# Altium project ProbeAmp.PrjPcb
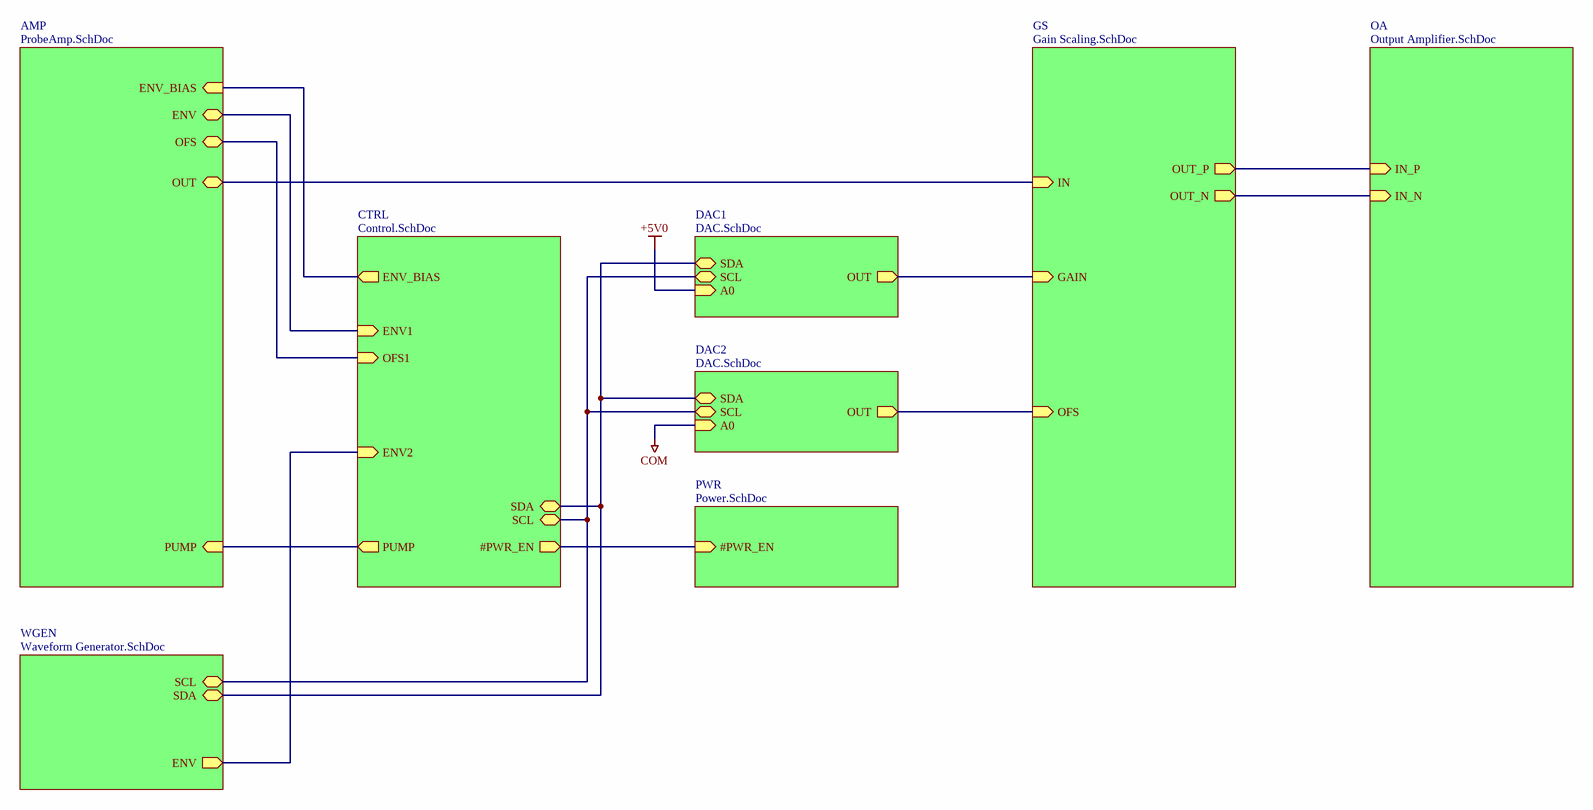
[diagram p0: Top.SchDoc]
8 sheets, 153 parts. Net scope: hierarchical (ports join the sheet entries above them; power ports are global).
Sheets:
  Top.SchDoc
    PWR = Power.SchDoc
    AMP = ProbeAmp.SchDoc
    DAC1 = DAC.SchDoc
    DAC2 = DAC.SchDoc
    CTRL = Control.SchDoc
    WGEN = Waveform Generator.SchDoc
    GS = Gain Scaling.SchDoc
    OA = Output Amplifier.SchDoc

## Sheet Top.SchDoc
size 406 x 304 mm; SheetNumber: 1; SheetTotal: 8

### Sub-sheets
AMP = ProbeAmp.SchDoc: OUT (bidir), OFS (bidir), ENV (bidir), ENV_BIAS (in), PUMP (in)
CTRL = Control.SchDoc: OFS1 (in), ENV1 (in), ENV2 (in), SCL (bidir), SDA (bidir), #PWR_EN (out), PUMP (out), ENV_BIAS (out)
DAC1 = DAC.SchDoc: OUT (out), SCL (bidir), SDA (bidir), A0 (in)
DAC2 = DAC.SchDoc: OUT (out), SCL (bidir), SDA (bidir), A0 (in)
GS = Gain Scaling.SchDoc: IN (in), OUT_P (out), OUT_N (out), GAIN (in), OFS (in)
OA = Output Amplifier.SchDoc: IN_P (in), IN_N (in)
PWR = Power.SchDoc: #PWR_EN (in)
WGEN = Waveform Generator.SchDoc: SCL (bidir), SDA (bidir), ENV (out)

### Nets
#PWR_EN: sheet PWR/#PWR_EN, sheet CTRL/#PWR_EN
SCL: sheet DAC1/SCL, sheet DAC2/SCL, sheet CTRL/SCL, sheet WGEN/SCL
SDA: sheet DAC1/SDA, sheet DAC2/SDA, sheet CTRL/SDA, sheet WGEN/SDA
NetC?#28_1: sheet AMP/PUMP, sheet CTRL/PUMP
NetC?#43_2: sheet CTRL/ENV2, sheet WGEN/ENV
NetC?#48_2: sheet GS/OUT_P, sheet OA/IN_P
NetC?#50_2: sheet GS/OUT_N, sheet OA/IN_N
NetC?_DAC1#2_2: sheet DAC1/OUT, sheet GS/GAIN
NetC?_DAC2#2_2: sheet DAC2/OUT, sheet GS/OFS
NetD2_1: sheet AMP/OUT, sheet GS/IN
NetD?#1_1: sheet AMP/ENV_BIAS, sheet CTRL/ENV_BIAS
NetU?#9_1: sheet AMP/ENV, sheet CTRL/ENV1
NetU?#10_6: sheet AMP/OFS, sheet CTRL/OFS1

### Notes on the sheet
- Sheet Name:
- Date:
- Sheet
- Designer:
- of

## Sheet Power.SchDoc
size 406 x 304 mm; SheetNumber: 2; SheetTotal: 8
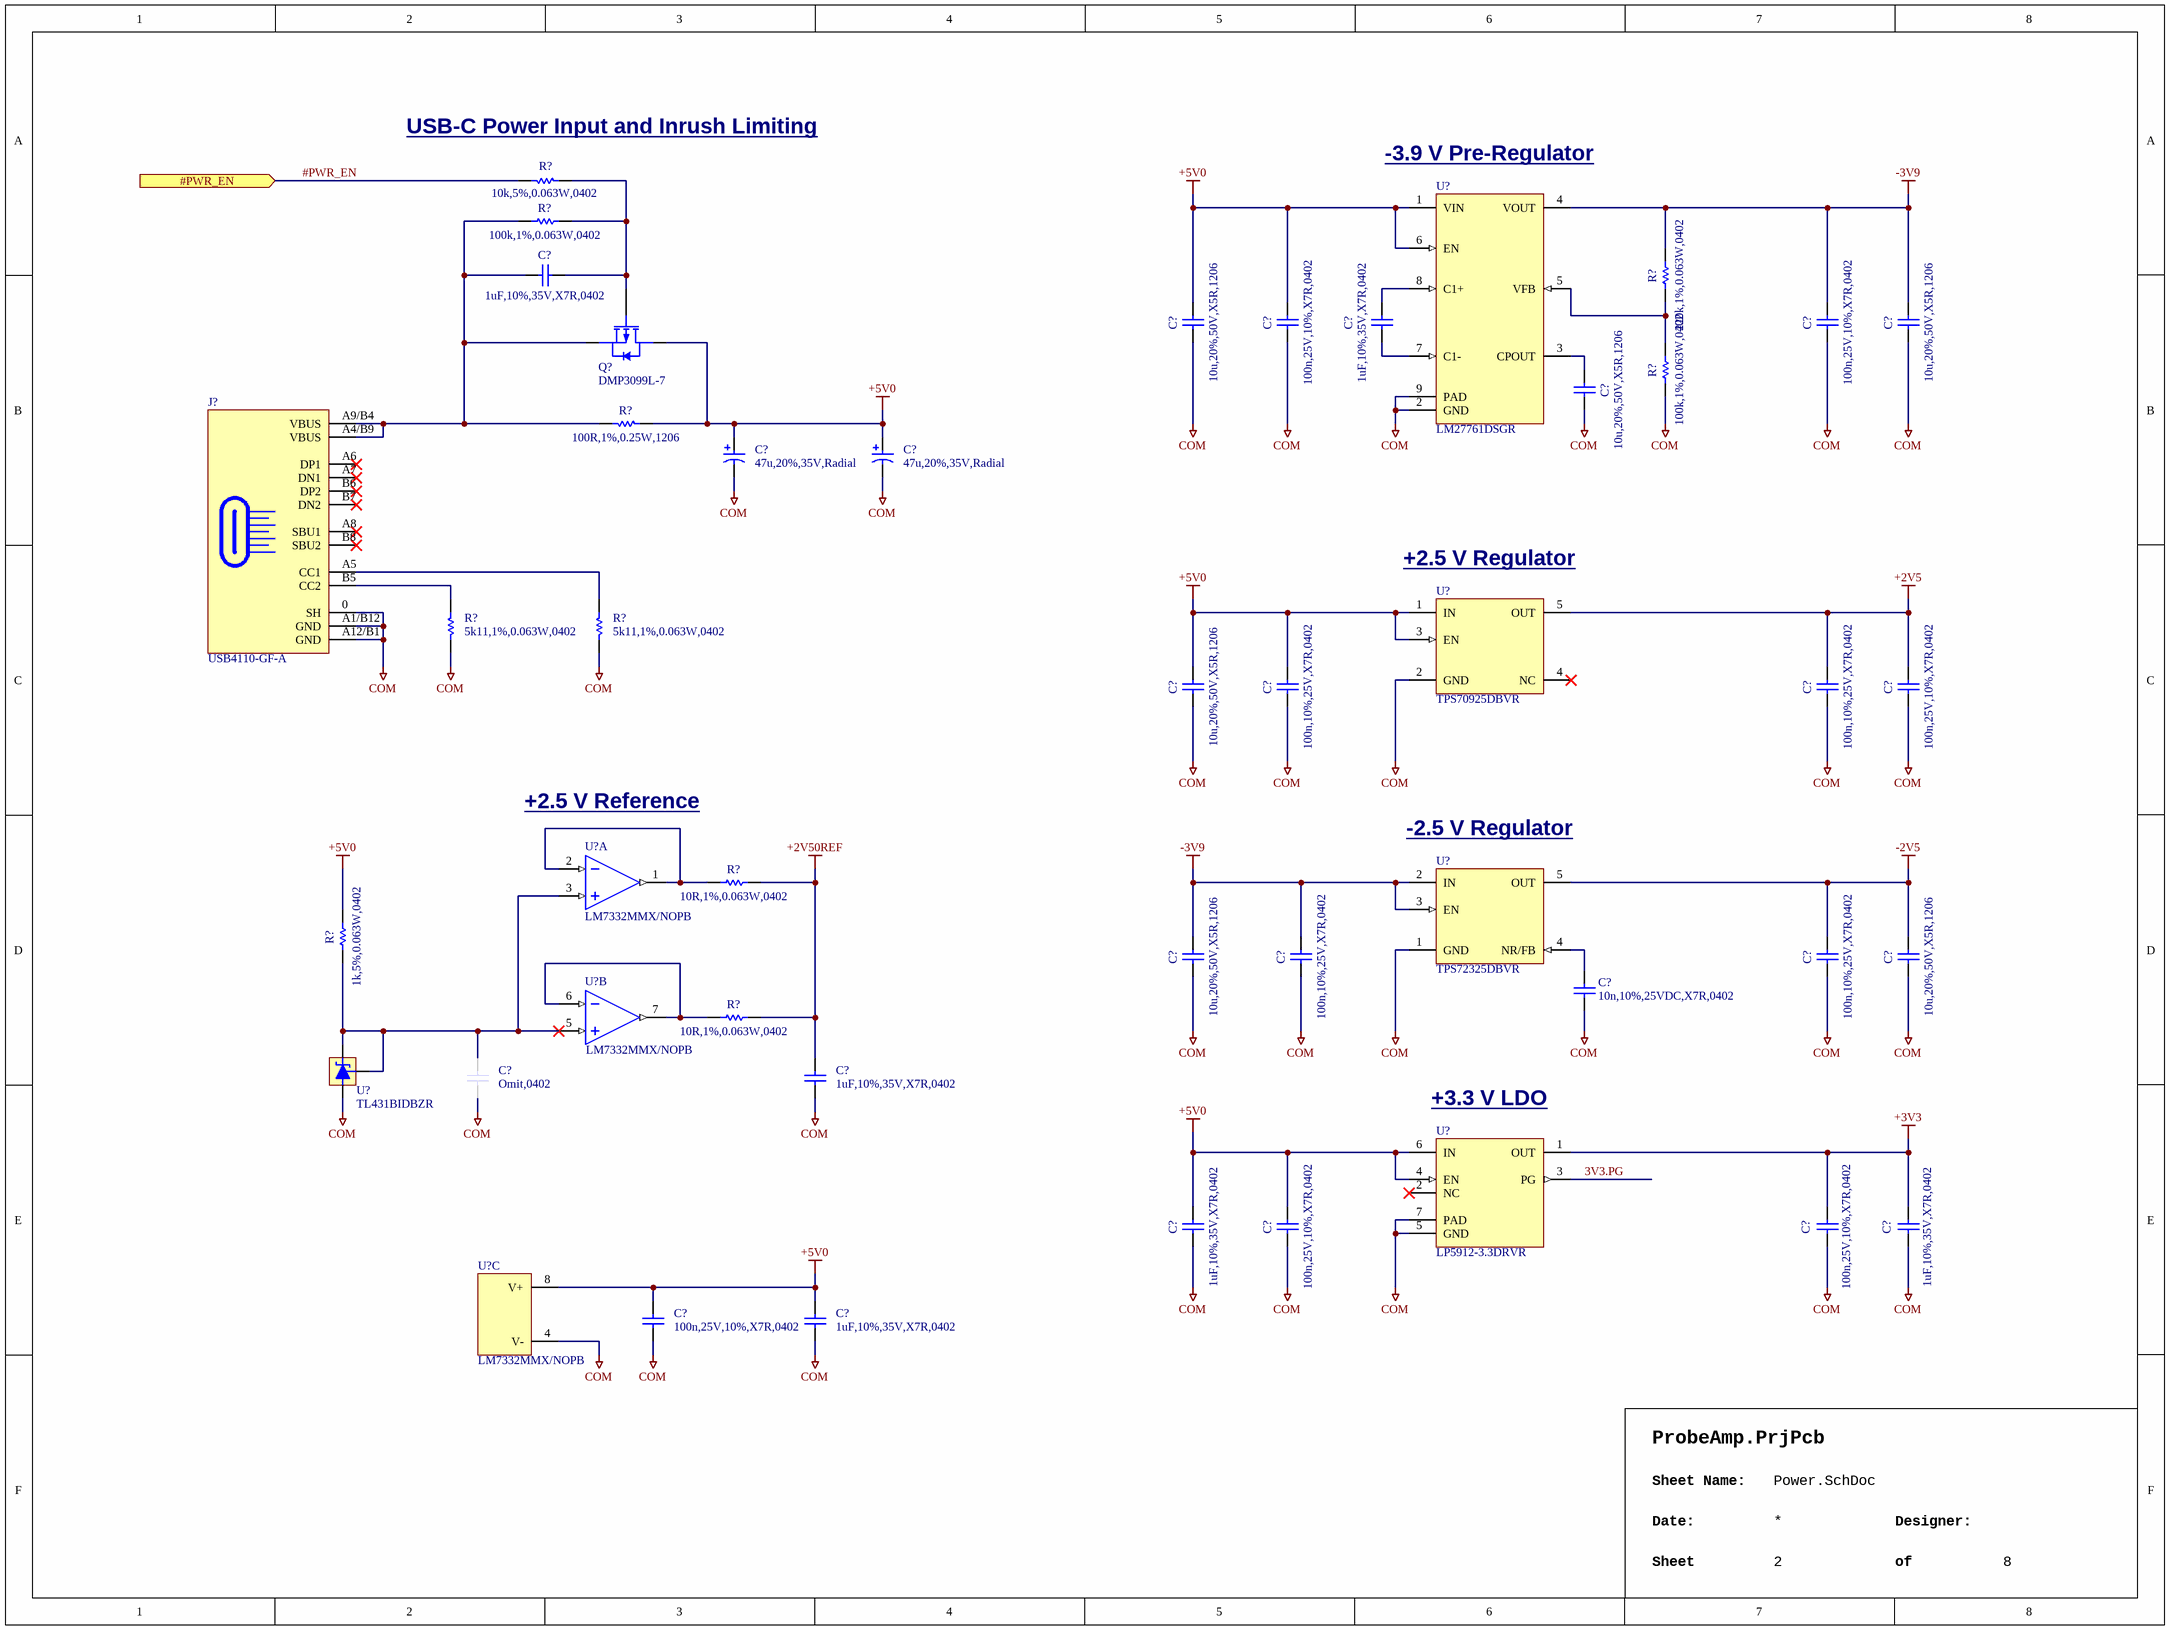
[diagram p1: Power.SchDoc]

### Parts
(Parts that share a designator on the sheet are numbered #1, #2 ... from top to bottom, then left to right.)
C?#1  1uF,10%,35V,X7R,0402  [CAPC1005X06N]
C?#2  10u,20%,50V,X5R,1206  [CAPC3216X16N]
C?#3  100n,25V,10%,X7R,0402  [CAPC1005X06N]
C?#4  1uF,10%,35V,X7R,0402  [CAPC1005X06N]
C?#5  100n,25V,10%,X7R,0402  [CAPC1005X06N]
C?#6  10u,20%,50V,X5R,1206  [CAPC3216X16N]
C?#7  10u,20%,50V,X5R,1206  [CAPC3216X16N]
C?#8  47u,20%,35V,Radial  [KEMET_ESKXXXXXXXXC3XX]
C?#9  47u,20%,35V,Radial  [KEMET_ESKXXXXXXXXC3XX]
C?#10  10u,20%,50V,X5R,1206  [CAPC3216X16N]
C?#11  100n,10%,25V,X7R,0402  [CAPC1005X06N]
C?#12  100n,10%,25V,X7R,0402  [CAPC1005X06N]
C?#13  100n,25V,10%,X7R,0402  [CAPC1005X06N]
C?#14  10u,20%,50V,X5R,1206  [CAPC3216X16N]
C?#15  100n,10%,25V,X7R,0402  [CAPC1005X06N]
C?#16  100n,10%,25V,X7R,0402  [CAPC1005X06N]
C?#17  10u,20%,50V,X5R,1206  [CAPC3216X16N]
C?#18  10n,10%,25VDC,X7R,0402  [CAPC1005X06N]
C?#19  Omit,0402  [CAPC1005X06N]  (no BOM)
C?#20  1uF,10%,35V,X7R,0402  [CAPC1005X06N]
C?#21  1uF,10%,35V,X7R,0402  [CAPC1005X06N]
C?#22  100n,25V,10%,X7R,0402  [CAPC1005X06N]
C?#23  100n,25V,10%,X7R,0402  [CAPC1005X06N]
C?#24  1uF,10%,35V,X7R,0402  [CAPC1005X06N]
C?#25  100n,25V,10%,X7R,0402  [CAPC1005X06N]
C?#26  1uF,10%,35V,X7R,0402  [CAPC1005X06N]
J?#1  USB4110-GF-A  [GCT_USB4110-GF-A]
Q?  DMP3099L-7  [DIODES_SOT23]
R?#1  10k,5%,0.063W,0402  [RESC1005X04N]
R?#2  100k,1%,0.063W,0402  [RESC1005X04N]
R?#3  220k,1%,0.063W,0402  [RESC1005X04N]
R?#4  100k,1%,0.063W,0402  [RESC1005X04N]
R?#5  100R,1%,0.25W,1206  [SEI_PKG_RMCF1206]
R?#6  5k11,1%,0.063W,0402  [RESC1005X04N]
R?#7  5k11,1%,0.063W,0402  [RESC1005X04N]
R?#8  10R,1%,0.063W,0402  [RESC1005X04N]
R?#9  1k,5%,0.063W,0402  [RESC1005X04N]
R?#10  10R,1%,0.063W,0402  [RESC1005X04N]
U?#1  LM27761DSGR  [TEXASINSTRUMENTS_PKG_DSG0008A]
U?#2  TPS70925DBVR  [TEXASINSTRUMENTS_PKG_DBV0005A]
U?#3  LM7332MMX/NOPB  [TEXASINSTRUMENTS_PKG_DGK0008A]  (part A of 3)
U?#4  TPS72325DBVR  [TEXASINSTRUMENTS_PKG_DBV0005A]
U?#5  LM7332MMX/NOPB  [TEXASINSTRUMENTS_PKG_DGK0008A]  (part B of 3)
U?#6  TL431BIDBZR  [SOT95P240X120-3N]
U?#7  LP5912-3.3DRVR  [SON65P200X80-6N]
U?#8  LM7332MMX/NOPB  [TEXASINSTRUMENTS_PKG_DGK0008A]  (part C of 3)

### Ports
#PWR_EN (in)

### Nets
+2V5: C?#12.2 C?#13.2 U?#2.5(OUT)
+2V50REF: C?#20.2 R?#8.2 R?#10.2
+3V3: C?#23.2 C?#24.2 U?#7.1(OUT)
+5V0: C?#2.2 C?#3.2 C?#8.1 C?#9.1 C?#10.2 C?#11.2 C?#21.2 C?#22.2 C?#25.2 C?#26.2 Q?.3(D) R?#5.1 R?#9.2 U?#1.1(VIN) U?#1.6(EN) U?#2.1(IN) U?#2.3(EN) U?#7.4(EN) U?#7.6(IN) U?#8.8(V+)  [project net A0]
-2V5: C?#16.2 C?#17.2 U?#4.5(OUT)
-3V9: C?#5.2 C?#6.2 C?#14.2 C?#15.2 R?#3.1 U?#1.4(VOUT) U?#4.2(IN) U?#4.3(EN)
COM: C?#2.1 C?#3.1 C?#5.1 C?#6.1 C?#7.1 C?#8.2 C?#9.2 C?#10.1 C?#11.1 C?#12.1 C?#13.1 C?#14.1 C?#15.1 C?#16.1 C?#17.1 C?#18.1 C?#19.1 C?#20.1 C?#21.1 C?#22.1 C?#23.1 C?#24.1 C?#25.1 C?#26.1 J?#1.0(SH) J?#1.A1/B12(GND) J?#1.A12/B1(GND) R?#4.2 R?#6.2 R?#7.2 U?#1.2(GND) U?#1.9(PAD) U?#2.2(GND) U?#4.1(GND) U?#6.3 U?#7.5(GND) U?#7.7(PAD) U?#8.4(V-)  [project net A0]
3V3.PG: U?#7.3(PG)
#PWR_EN: R?#1.1 ; port #PWR_EN
NetC?#1_1: C?#1.1 Q?.1(G) R?#1.2 R?#2.2
NetC?#1_2: C?#1.2 J?#1.A4/B9(VBUS) J?#1.A9/B4(VBUS) Q?.2(S) R?#2.1 R?#5.2
NetC?#4_1: C?#4.1 U?#1.7(C1-)
NetC?#4_2: C?#4.2 U?#1.8(C1+)
NetC?#7_2: C?#7.2 U?#1.3(CPOUT)
NetC?#18_2: C?#18.2 U?#4.4(NR/FB)
NetC?#19_2: C?#19.2 R?#9.1 U?#3.3(INA+) U?#5.5(INB+) U?#6.1 U?#6.2
NetJ?#1_A5: J?#1.A5(CC1) R?#7.1
NetJ?#1_B5: J?#1.B5(CC2) R?#6.1
NetR?#3_2: R?#3.2 R?#4.1 U?#1.5(VFB)
NetR?#8_1: R?#8.1 U?#3.1(OUTA) U?#3.2(INA-)
NetR?#10_1: R?#10.1 U?#5.6(INB-) U?#5.7(OUTB)

Not connected (* = marked no-connect by the designer): J?#1 A6(DP1)* A7(DN1)* A8(SBU1)* B6(DP2)* B7(DN2)* B8(SBU2)*; U?#2 4(NC)*; U?#7 2(NC)*

### Notes on the sheet
- (near R?#1) USB-C Power Input and Inrush Limiting
- (near U?#1) -3.9 V Pre-Regulator
- (near U?#2) +2.5 V Regulator
- +2.5 V Reference
- (near U?#4) -2.5 V Regulator
- (near U?#7) +3.3 V LDO
- Sheet Name:
- Date:
- Sheet
- Designer:
- of

### Library data of the parts
C?#1 C?#4 C?#20 C?#21 C?#24 C?#26 = CAP,Cer,1uF,35VDC,X5R,0402: 1 ï¿½F ï¿½10% 35V Ceramic Capacitor X5R 0402 (1005 Metric); Manufacturer 1: TDK Corporation; Manufacturer 1 Part Number: C1005X5R1V105K050BC; Vendor 1 Part Number: 445-9073-1-ND; Vendor 1: Digikey; Value: 1u; Part Name: CAP,Cer,1uF,35VDC,X5R,0402; CreatedBy: Judd Foster; HelpURL: https://product.tdk.com/info/en/catalog/datasheets/mlcc_commercial_general_en.pdf?ref_disty=digikey
C?#2 C?#6 C?#7 C?#10 C?#14 C?#17 = CAP,Cer,10uF,50VDC,X5R,1206: 10ï¿½F ï¿½20% 50V Ceramic Capacitor X5R 1206 (3216 Metric); Manufacturer 1: Samsung Electro-Mechanics; Manufacturer 1 Part Number: CL31A106MBHNNNE; Vendor 1 Part Number: 1276-6736-1-ND; Vendor 1: Digikey; Part Name: CAP,Cer,10uF,50VDC,X5R,1206; CreatedBy: Judd Foster; HelpURL: https://www.samsungsem.com/resources/file/global/support/product_catalog/MLCC.pdf; Value: 10u
C?#3 C?#5 C?#13 C?#22 C?#23 C?#25 = CAP,Cer,100nF,10%,25VDC,X7R,0402: 0.1ï¿½F ï¿½10% 25V Ceramic Capacitor X7R 0402 (1005 Metric); Manufacturer 1: Murata Electronics; Manufacturer 1 Part Number: GRM155R71E104KE14J; Vendor 1 Part Number: 490-14603-1-ND; Vendor 1: DigiKey; Value: 100nF; Part Name: CAP,Cer,100nF,10%,25VDC,X7R,0402; CreatedBy: Judd Foster; HelpURL: https://search.murata.co.jp/Ceramy/image/img/A01X/G101/ENG/GRM155R71E104KE14-01.pdf
C?#8 C?#9 = CAP,Alum,47uF,20%,35V,Radial: 47 ÂµF 35 V Aluminum Electrolytic Capacitors Radial, Can 2000 Hrs @ 85Â°C; Manufacturer 1: KEMET; Manufacturer 1 Part Number: ESK476M035AC3EA; Vendor 1 Part Number: 399-18276-1-ND; Vendor 1: Digikey; Part Name: CAP,Alum,47uF,20%,35V,Radial; CreatedBy: Judd Foster; HelpURL: https://connect.kemet.com:7667/gateway/IntelliData-ComponentDocumentation/1.0/download/datasheet/ESK476M035AC3EA; Value: 47u
C?#11 C?#12 C?#15 C?#16 = CAP,Cer,100nF,10%,25V,X7R,0402: 0.1ï¿½F ï¿½10% 25V Ceramic Capacitor X7R 0402 (1005 Metric); Manufacturer 1: Murata Electronics; Manufacturer 1 Part Number: GRM155R71E104KE14J; Vendor 1 Part Number: 490-14603-1-ND; Vendor 1: DigiKey; Value: 100nF; Part Name: CAP,Cer,100nF,10%,25V,X7R,0402; CreatedBy: Judd Foster; HelpURL: https://search.murata.co.jp/Ceramy/image/img/A01X/G101/ENG/GRM155R71E104KE14-01.pdf
C?#18 = CAP,Cer,10nF,10%,25VDC,X7R,0402: 10000pF ï¿½10% 25V Ceramic Capacitor X7R 0402 (1005 Metric); Manufacturer 1: Murata Electronics; Manufacturer 1 Part Number: GCM155R71E103KA37D; Vendor 1 Part Number: 490-6043-1-ND; Vendor 1: Digikey; Part Name: CAP,Cer,10nF,10%,25VDC,X7R,0402; CreatedBy: Judd Foster; HelpURL: https://psearch.en.murata.com/capacitor/product/GCM155R71E103KA37%23.pdf; Value: 10n,10%,25VDC,X7R,0402
C?#19 = CAP,Omit,0402: Omit; Part Name: CAP,Omit,0402; CreatedBy: Judd Foster; HelpURL: N/A; Manufacturer 1: N/A; Manufacturer 1 Part Number: N/A; Vendor 1: N/A; Vendor 1 Part Number: N/A; Value: Omit
J?#1 = Conn,USB_C,SMD: USB-C (USB TYPE-C) USB 2.0 Receptacle Connector 24 (16+8 Dummy) Position Surface Mount, Right Angle; Manufacturer 1: GCT; Vendor 1 Part Number: 2073-USB4110-GF-A-1-ND; Vendor 1: Digikey; Part Name: Conn,USB_C,SMD; CreatedBy: Judd Foster; HelpURL: https://gct.co/files/drawings/usb4110.pdf; Manufacturer 1 Part Number: USB4110-GF-A
Q? = MOSFET,P Ch,30V,3.8A: P-Channel 30 V 3.8A (Ta) 1.08W (Ta) Surface Mount SOT-23-3; Manufacturer 1: Diodes Incorporated; Vendor 1 Part Number: DMP3099L-7DICT-ND; Vendor 1: Digikey; Part Name: MOSFET,P Ch,30V,3.8A; CreatedBy: Judd Foster; HelpURL: https://www.diodes.com/assets/Datasheets/DMP3099L.pdf; Manufacturer 1 Part Number: DMP3099L-7
R?#1 = RES,10k,5%,0.063W,0402: 10 kOhms ï¿½5% 0.063W, 1/16W Chip Resistor 0402 (1005 Metric) Automotive AEC-Q200 Thick Film; Manufacturer 1: Stackpole Electronics Inc; Manufacturer 1 Part Number: RMCF0402JT10K0; Vendor 1 Part Number: RMCF0402JT10K0CT-ND; Vendor 1: DIgikey; Part Name: RES,10k,5%,0.063W,0402; CreatedBy: Judd Foster; HelpURL: https://www.seielect.com/catalog/sei-rmcf_rmcp.pdf; Value: 10k
R?#2 R?#4 = RES,100k,1%,0.063W,0402: 100 kOhms Â±1% 0.063W, 1/16W Chip Resistor 0402 (1005 Metric) Moisture Resistant Thick Film; Manufacturer 1: YAGEO; Manufacturer 1 Part Number: RC0402FR-07100KL; Vendor 1 Part Number: 311-100KLRCT-ND; Vendor 1: DigiKey; Part Name: RES,100k,1%,0.063W,0402; CreatedBy: Judd Foster; HelpURL: https://www.yageo.com/upload/media/product/products/datasheet/rchip/PYu-RC_Group_51_RoHS_L_12.pdf; Value: 100k
R?#3 = RES,220k,1%,0.063W,0402: 220 kOhms Â±1% 0.063W, 1/16W Chip Resistor 0402 (1005 Metric) Moisture Resistant Thick Film; Manufacturer 1: YAGEO; Manufacturer 1 Part Number: RC0402FR-07220KL; Vendor 1 Part Number: 311-220KLRCT-ND; Vendor 1: Digikey; Part Name: RES,220k,1%,0.063W,0402; CreatedBy: Judd Foster; HelpURL: https://www.yageo.com/upload/media/product/products/datasheet/rchip/PYu-RC_Group_51_RoHS_L_12.pdf; Value: 220k
R?#5 = RES,100R,1%,0.25W,1206: 100 Ohms Â±1% 0.25W, 1/4W Chip Resistor 1206 (3216 Metric) Automotive AEC-Q200 Thick Film; Manufacturer 1: Stackpole Electronics Inc; Manufacturer 1 Part Number: RMCF1206FT100R; Vendor 1 Part Number: RMCF1206FT100RCT-ND; Vendor 1: DigiKey; Part Name: RES,100R,1%,0.25W,1206; CreatedBy: Judd Foster; HelpURL: https://www.seielect.com/catalog/sei-rmcf_rmcp.pdf; Value: 100R
R?#6 R?#7 = RES,5k11,1%,0.063W,0402: 5.11 kOhms ï¿½1% 0.063W, 1/16W Chip Resistor 0402 (1005 Metric) Automotive AEC-Q200, Moisture Resistant Thick Film; Manufacturer 1: Yageo; Manufacturer 1 Part Number: AC0402FR-075K11L; Vendor 1 Part Number: 13-AC0402FR-075K11LCT-ND; Vendor 1: Digikey; Part Name: RES,5k11,1%,0.063W,0402; CreatedBy: Judd Foster; HelpURL: https://www.yageo.com/upload/media/product/productsearch/datasheet/rchip/PYu-AC_51_RoHS_L_7.pdf; Value: 5k11
R?#8 R?#10 = RES,10R,1%,0.063W,0402: 10 Ohms ï¿½1% 0.063W, 1/16W Chip Resistor 0402 (1005 Metric) Automotive AEC-Q200 Thick Film; Manufacturer 1: Panasonic Electronic Components; Manufacturer 1 Part Number: ERJ-2RKF10R0X; Vendor 1 Part Number: P10.0LCT-ND; Vendor 1: Digikey; Part Name: RES,10R,1%,0.063W,0402; CreatedBy: Judd Foster; HelpURL: https://industrial.panasonic.com/cdbs/www-data/pdf/RDA0000/AOA0000C304.pdf; Value: 10R
R?#9 = RES,1k,5%,0.063W,0402: 1 kOhms ï¿½5% 0.063W, 1/16W Chip Resistor 0402 (1005 Metric) Automotive AEC-Q200 Thick Film; Manufacturer 1: Stackpole Electronics Inc; Manufacturer 1 Part Number: RMCF0402JT1K00; Vendor 1 Part Number: RMCF0402JT1K00CT-ND; Vendor 1: DIgikey; Part Name: RES,1k,5%,0.063W,0402; CreatedBy: Judd Foster; HelpURL: https://www.seielect.com/catalog/sei-rmcf_rmcp.pdf; Value: 1k
U?#1 = LM27761DSGR: Charge Pump Switching Regulator IC Negative Adjustable -1.5V 1 Output 250mA 8-WFDFN Exposed Pad; Manufacturer 1: Texas Instruments; Vendor 1 Part Number: 296-44379-1-ND; Vendor 1: DigiKey; Part Name: LM27761DSGR; CreatedBy: Judd Foster; HelpURL: https://www.ti.com/lit/ds/symlink/lm27761.pdf?HQS=dis-dk-null-digikeymode-dsf-pf-null-wwe&ts=1736913234763&ref_url=https%253A%252F%252Fwww.ti.com%252Fgeneral%252Fdocs%252Fsuppproductinfo.tsp%253FdistId%253D10%2526gotoUrl%253Dhttps%253A%252F%252Fwww.ti.com; Manufacturer 1 Part Number: LM27761DSGR
U?#2 = TPS70925DBVR: Linear Voltage Regulator IC Positive Fixed 1 Output 150mA SOT-23-5; Manufacturer 1: Texas Instruments; Vendor 1 Part Number: 296-40923-1-ND; Vendor 1: DigiKey; Part Name: TPS70925DBVR; CreatedBy: Judd Foster; HelpURL: https://www.ti.com/lit/ds/symlink/tps709.pdf?HQS=dis-dk-null-digikeymode-dsf-pf-null-wwe&ts=1736883811582; Manufacturer 1 Part Number: TPS70925DBVR
U?#3 U?#5 U?#8 = LM7332MMX_NOPB: General Purpose Amplifier 2 Circuit Rail-to-Rail 8-VSSOP; Manufacturer 1: Texas Instruments; Vendor 1 Part Number: 296-LM7332MMX/NOPBCT-ND; Vendor 1: DigiKey; Part Name: LM7332MMX_NOPB; CreatedBy: Judd Foster; HelpURL: https://www.ti.com/lit/ds/symlink/lm7332.pdf?HQS=dis-dk-null-digikeymode-dsf-pf-null-wwe&ts=1730932081789&ref_url=https%253A%252F%252Fwww.ti.com%252Fgeneral%252Fdocs%252Fsuppproductinfo.tsp%253FdistId%253D10%2526gotoUrl%253Dhttps%253A%252F%252Fwww.ti.com%; Manufacturer 1 Part Number: LM7332MMX/NOPB
U?#4 = TPS72325DBVR: Linear Voltage Regulator IC Negative Fixed 1 Output 200mA SOT-23-5; Manufacturer 1: Texas Instruments; Vendor 1 Part Number: 296-39479-1-ND; Vendor 1: DigiKey; Part Name: TPS72325DBVR; CreatedBy: Judd Foster; HelpURL: https://www.ti.com/lit/ds/symlink/tps723.pdf?HQS=dis-dk-null-digikeymode-dsf-pf-null-wwe&ts=1736917966718&ref_url=https%253A%252F%252Fwww.ti.com%252Fgeneral%252Fdocs%252Fsuppproductinfo.tsp%253FdistId%253D10%2526gotoUrl%253Dhttps%253A%252F%252Fwww.ti.com%; Manufacturer 1 Part Number: TPS72325DBVR
U?#6 = TL431BIDBZR: IC VREF SHUNT 36V 0.5% SOT23-3; Manufacturer 1: Texas Instruments; Vendor 1 Part Number: 296-18872-1-ND; Vendor 1: Digikey; Part Name: TL431BIDBZR; CreatedBy: Judd Foster; HelpURL: http://www.ti.com/lit/ds/symlink/tl431.pdf; Manufacturer 1 Part Number: TL431BIDBZR
U?#7 = LP5912-3.3DRVR: Linear Voltage Regulator IC Positive Fixed 1 Output 500mA 6-WSON (2x2); Manufacturer 1: Texas Instruments; Vendor 1 Part Number: 296-47214-1-ND; Vendor 1: Digikey; Part Name: LP5912-3.3DRVR; CreatedBy: Judd Foster; HelpURL: http://www.ti.com/general/docs/suppproductinfo.tsp?distId=10&gotoUrl=http%3A%2F%2Fwww.ti.com%2Flit%2Fgpn%2Flp5912; Manufacturer 1 Part Number: LP5912-3.3DRVR

## Sheet ProbeAmp.SchDoc
size 406 x 304 mm; SheetNumber: 3; SheetTotal: 8
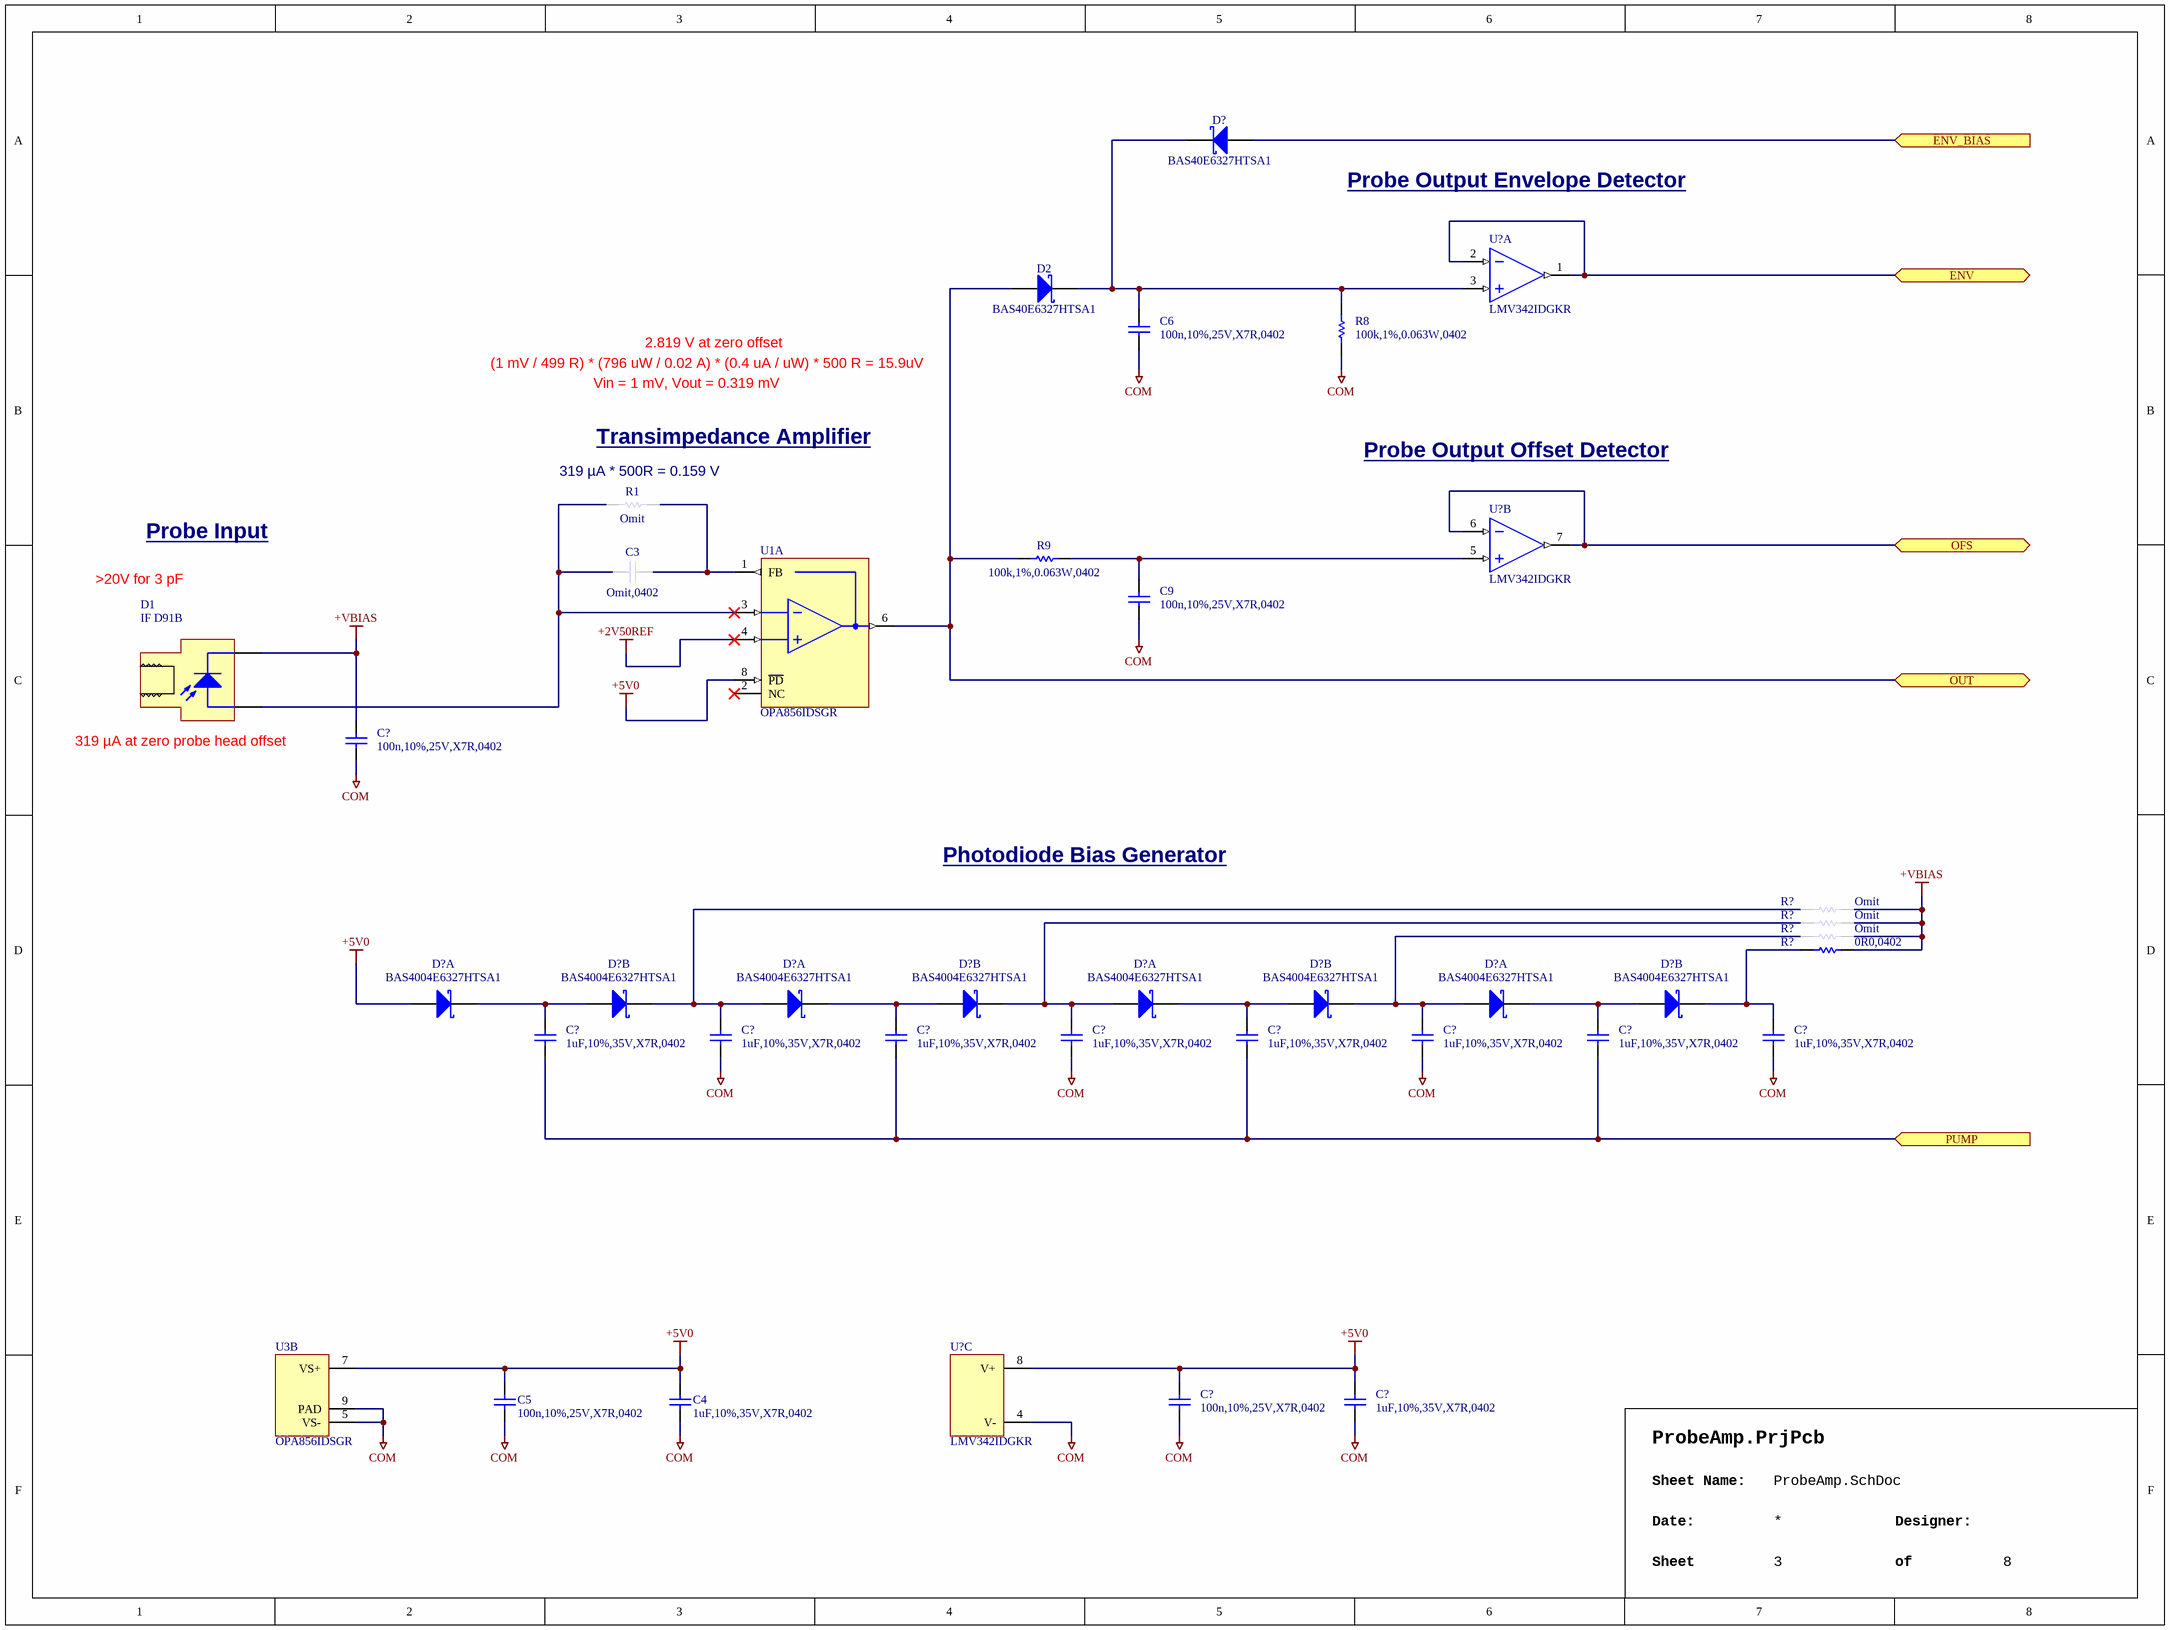
[diagram p2: ProbeAmp.SchDoc]

### Parts
(Parts that share a designator on the sheet are numbered #1, #2 ... from top to bottom, then left to right.)
C3  Omit,0402  [CAPC1005X06N]  (no BOM)
C4  1uF,10%,35V,X7R,0402  [CAPC1005X06N]
C5  100n,10%,25V,X7R,0402  [CAPC1005X06N]
C6  100n,10%,25V,X7R,0402  [CAPC1005X06N]
C9  100n,10%,25V,X7R,0402  [CAPC1005X06N]
C?#27  100n,10%,25V,X7R,0402  [CAPC1005X06N]
C?#28  1uF,10%,35V,X7R,0402  [CAPC1005X06N]
C?#29  1uF,10%,35V,X7R,0402  [CAPC1005X06N]
C?#30  1uF,10%,35V,X7R,0402  [CAPC1005X06N]
C?#31  1uF,10%,35V,X7R,0402  [CAPC1005X06N]
C?#32  1uF,10%,35V,X7R,0402  [CAPC1005X06N]
C?#33  1uF,10%,35V,X7R,0402  [CAPC1005X06N]
C?#34  1uF,10%,35V,X7R,0402  [CAPC1005X06N]
C?#35  1uF,10%,35V,X7R,0402  [CAPC1005X06N]
C?#36  100n,10%,25V,X7R,0402  [CAPC1005X06N]
C?#37  1uF,10%,35V,X7R,0402  [CAPC1005X06N]
D1  IF D91B  [INDUSTRIALFIBEROPTICS_IF-D91B]
D2  BAS40E6327HTSA1  [INFINEON_PKG_SOT23]
D?#1  BAS40E6327HTSA1  [INFINEON_PKG_SOT23]
D?#2  BAS4004E6327HTSA1  [INFINEON_PKG_SOT23]  (part A of 2)
D?#3  BAS4004E6327HTSA1  [INFINEON_PKG_SOT23]  (part B of 2)
D?#4  BAS4004E6327HTSA1  [INFINEON_PKG_SOT23]  (part A of 2)
D?#5  BAS4004E6327HTSA1  [INFINEON_PKG_SOT23]  (part B of 2)
D?#6  BAS4004E6327HTSA1  [INFINEON_PKG_SOT23]  (part A of 2)
D?#7  BAS4004E6327HTSA1  [INFINEON_PKG_SOT23]  (part B of 2)
D?#8  BAS4004E6327HTSA1  [INFINEON_PKG_SOT23]  (part A of 2)
D?#9  BAS4004E6327HTSA1  [INFINEON_PKG_SOT23]  (part B of 2)
R1  Omit  [RESC1005X04N]  (no BOM)
R8  100k,1%,0.063W,0402  [RESC1005X04N]
R9  100k,1%,0.063W,0402  [RESC1005X04N]
R?#11  Omit  [RESC1005X04N]  (no BOM)
R?#12  Omit  [RESC1005X04N]  (no BOM)
R?#13  Omit  [RESC1005X04N]  (no BOM)
R?#14  0R0,0402  [RESC1005X04N]
U1  OPA856IDSGR  [TEXASINSTRUMENTS_PKG_DSG0008A]  (part A of 2)
U3  OPA856IDSGR  [TEXASINSTRUMENTS_PKG_DSG0008A]  (part B of 2)
U?#9  LMV342IDGKR  [TEXASINSTRUMENTS_PKG_DGK0008A]  (part A of 3)
U?#10  LMV342IDGKR  [TEXASINSTRUMENTS_PKG_DGK0008A]  (part B of 3)
U?#11  LMV342IDGKR  [TEXASINSTRUMENTS_PKG_DGK0008A]  (part C of 3)

### Ports
ENV (bidir), ENV_BIAS (in), OFS (bidir), OUT (bidir), PUMP (in)

### Nets
+2V50REF: U1.4(IN+)
+5V0: C4.2 C5.2 C?#36.2 C?#37.2 D?#2.1(A) U1.8(~{PD}) U3.7(VS+) U?#11.8(V+)  [project net A0]
+VBIAS: C?#27.2 D1.2(K) R?#11.2 R?#12.2 R?#13.2 R?#14.1
COM: C4.1 C5.1 C6.1 C9.1 C?#27.1 C?#29.1 C?#31.1 C?#33.1 C?#35.1 C?#36.1 C?#37.1 R8.1 U3.5(VS-) U3.9(PAD) U?#11.4(V-)  [project net A0]
NetC3_1: C3.1 D1.1(A) R1.1 U1.3(IN-)
NetC3_2: C3.2 R1.2 U1.1(FB)
NetC6_2: C6.2 D2.3(K) D?#1.3(K) R8.2 U?#9.3(1IN+)
NetC9_2: C9.2 R9.1 U?#10.5(2IN-)
NetC?#28_1: C?#28.1 C?#30.1 C?#32.1 C?#34.1 ; port PUMP
NetC?#28_2: C?#28.2 D?#2.3(K) D?#3.1(A)
NetC?#29_2: C?#29.2 D?#3.3(K) D?#4.1(A) R?#11.1
NetC?#30_2: C?#30.2 D?#4.3(K) D?#5.1(A)
NetC?#31_2: C?#31.2 D?#5.3(K) D?#6.1(A) R?#12.1
NetC?#32_2: C?#32.2 D?#6.3(K) D?#7.1(A)
NetC?#33_2: C?#33.2 D?#7.3(K) D?#8.1(A) R?#13.1
NetC?#34_2: C?#34.2 D?#8.3(K) D?#9.1(A)
NetC?#35_2: C?#35.2 D?#9.3(K) R?#14.2
NetD2_1: D2.1(A) R9.2 U1.6(OUT) ; port OUT
NetD?#1_1: D?#1.1(A) ; port ENV_BIAS
NetU?#9_1: U?#9.1(1OUT) U?#9.2(1IN-) ; port ENV
NetU?#10_6: U?#10.6(2IN+) U?#10.7(2OUT) ; port OFS

Not connected (* = marked no-connect by the designer): U1 2(NC)*

### Notes on the sheet
- Probe Output Envelope Detector
- (1 mV / 499 R) * (796 uW / 0.02 A) * (0.4 uA / uW) * 500 R = 15.9uV
- 2.819 V at zero offset
- Vin = 1 mV, Vout = 0.319 mV
- (near R1) 319 µA * 500R = 0.159 V
- Transimpedance Amplifier
- Probe Output Offset Detector
- >20V for 3 pF
- Probe Input
- (near D1) 319 µA at zero probe head offset
- Photodiode Bias Generator
- Sheet Name:
- Date:
- Sheet
- Designer:
- of

### Library data of the parts
C3 = CAP,Omit,0402: Omit; Part Name: CAP,Omit,0402; CreatedBy: Judd Foster; HelpURL: N/A; Manufacturer 1: N/A; Manufacturer 1 Part Number: N/A; Vendor 1: N/A; Vendor 1 Part Number: N/A; Value: Omit
C4 C?#28-C?#35 C?#37 = CAP,Cer,1uF,35VDC,X5R,0402: as C?#1 on sheet Power; Part Name: CAP,Cer,1uF,35VDC,X5R,0402; CreatedBy: Judd Foster; HelpURL: https://product.tdk.com/info/en/catalog/datasheets/mlcc_commercial_general_en.pdf?ref_disty=digikey
C5 C6 C9 C?#27 C?#36 = CAP,Cer,100nF,10%,25V,X7R,0402: as C?#11 on sheet Power; Part Name: CAP,Cer,100nF,10%,25V,X7R,0402; CreatedBy: Judd Foster; HelpURL: https://search.murata.co.jp/Ceramy/image/img/A01X/G101/ENG/GRM155R71E104KE14-01.pdf
D1 = RECEIVER,FIBER OPTIC,450-1050NM,IF-D91B: Fiber Optic Receiver General Purpose 100Mbps; Manufacturer 1: Industrial Fiber Optics; Vendor 1 Part Number: FB200-ND; Vendor 1: DigiKey; Part Name: RECEIVER,FIBER OPTIC,450-1050NM,IF-D91B; CreatedBy: Judd Foster; HelpURL: https://i-fiberoptics.com/pdf/ifd91b-1809.pdf; Manufacturer 1 Part Number: IF D91B
D2 D?#1 = Diode,Schottky,40V,1A,SOT23: Diode 40 V 120mA Surface Mount PG-SOT23; Manufacturer 1: Infineon Technologies; Vendor 1 Part Number: BAS40E6327HTSA1CT-ND; Vendor 1: DigiKey; Part Name: Diode,Schottky,40V,1A,SOT23; CreatedBy: Judd Foster; HelpURL: https://rocelec.widen.net/view/pdf/ukzfofyli6/INFNS19700-1.pdf?t.download=true&u=5oefqw; Manufacturer 1 Part Number: BAS40E6327HTSA1
D?#2-D?#9 = DIODE,Array,Schottky,Series,40V,120mA,SOT23: Diode Array 1 Pair Series Connection 40 V 120mA (DC) Surface Mount TO-236-3, SC-59, SOT-23-3; Manufacturer 1: Infineon Technologies; Vendor 1 Part Number: BAS4004E6327HTSA1CT-ND; Vendor 1: DigiKey; Part Name: DIODE,Array,Schottky,Series,40V,120mA,SOT23; CreatedBy: Judd Foster; HelpURL: https://rocelec.widen.net/view/pdf/ukzfofyli6/INFNS19700-1.pdf?t.download=true&u=5oefqw; Manufacturer 1 Part Number: BAS4004E6327HTSA1
R1 R?#11-R?#13 = RES,Omit,0402: Part Name: RES,Omit,0402; CreatedBy: Judd Foster; HelpURL: N/A; Manufacturer 1: N/A; Manufacturer 1 Part Number: N/A; Vendor 1: N/A; Vendor 1 Part Number: N/A; Value: Omit
R8 R9 = RES,100k,1%,0.063W,0402: as R?#2 on sheet Power; Part Name: RES,100k,1%,0.063W,0402; CreatedBy: Judd Foster; HelpURL: https://www.yageo.com/upload/media/product/products/datasheet/rchip/PYu-RC_Group_51_RoHS_L_12.pdf; Value: 100k
R?#14 = RES,0R0,0402: 0 Ohms Jumper 0.1W, 1/10W Chip Resistor 0402 (1005 Metric) Automotive AEC-Q200 Thick Film; Manufacturer 1: Panasonic Electronic Components; Manufacturer 1 Part Number: ERJ-2GE0R00X; Vendor 1 Part Number: P0.0JCT-ND; Vendor 1: Digikey; Value: 0R; Part Name: RES,0R0,0402; CreatedBy: Judd Foster; HelpURL: https://industrial.panasonic.com/cdbs/www-data/pdf/RDA0000/AOA0000C301.pdf
U1 U3 = OPA856IDSGR: General Purpose Amplifier 1 Circuit Rail-to-Rail 8-WSON (2x2); Manufacturer 1: Texas Instruments; Vendor 1 Part Number: 296-OPA856IDSGRCT-ND; Vendor 1: DigiKey; Part Name: OPA856IDSGR; CreatedBy: Judd Foster; HelpURL: https://www.ti.com/lit/ds/symlink/opa856.pdf?HQS=dis-dk-null-digikeymode-dsf-pf-null-wwe&ts=1736226484393; Manufacturer 1 Part Number: OPA856IDSGR
U?#9-U?#11 = LMV342IDGKR: CMOS Amplifier 2 Circuit Rail-to-Rail 8-VSSOP; Manufacturer 1: Texas Instruments; Vendor 1 Part Number: 296-22012-1-ND; Vendor 1: DigiKey; Part Name: LMV342IDGKR; CreatedBy: Judd Foster; HelpURL: https://www.ti.com/lit/ds/symlink/lmv341.pdf?HQS=dis-dk-null-digikeymode-dsf-pf-null-wwe&ts=1738729278639&ref_url=https%253A%252F%252Fwww.ti.com%252Fgeneral%252Fdocs%252Fsuppproductinfo.tsp%253FdistId%253D10%2526gotoUrl%253Dhttps%253A%252F%252Fwww.ti.com%; Manufacturer 1 Part Number: LMV342IDGKR

## Sheet DAC.SchDoc
size 406 x 304 mm; SheetNumber: 5; SheetTotal: 8
Used 2 times, as channels DAC1, DAC2. Parts and nets are listed once, with the designators drawn on the sheet.
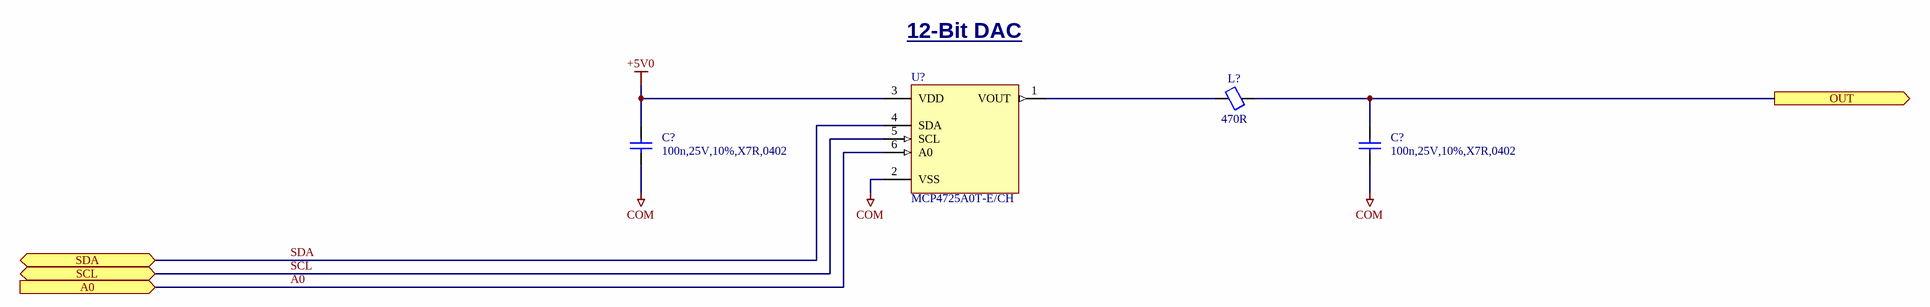
[diagram p3: DAC.SchDoc]

### Parts
(Parts that share a designator on the sheet are numbered #1, #2 ... from top to bottom, then left to right.)
C?#1  100n,25V,10%,X7R,0402  [CAPC1005X06N]
C?#2  100n,25V,10%,X7R,0402  [CAPC1005X06N]
L?  470R  [INDC1005X05N]
U?  MCP4725A0T-E/CH  [SOTFL95P260X145-6]

### Ports
A0 (in), OUT (out), SCL (bidir), SDA (bidir)

### Nets
+5V0: C?#1.2 U?.3(VDD)
COM: C?#1.1 C?#2.1 U?.2(VSS)
A0: U?.6(A0) ; port A0
OUT: C?#2.2 L?.1 ; port OUT
SCL: U?.5(SCL) ; port SCL
SDA: U?.4(SDA) ; port SDA
NetL?_2: L?.2 U?.1(VOUT)

### Channels
DAC1: designators C?=C?_DAC1#2 C?=C?_DAC1#1 L?=L?_DAC1 U?=U?_DAC1; ports A0=A0 OUT=NetC?_DAC1#2_2 SCL=SCL SDA=SDA
DAC2: designators C?=C?_DAC2#2 C?=C?_DAC2#1 L?=L?_DAC2 U?=U?_DAC2; ports A0=A0 OUT=NetC?_DAC2#2_2 SCL=SCL SDA=SDA

### Notes on the sheet
- 12-Bit DAC
- Sheet Name:
- Date:
- Sheet
- Designer:
- of

### Library data of the parts
C?#1 C?#2 = CAP,Cer,100nF,10%,25VDC,X7R,0402: as C?#3 on sheet Power; Part Name: CAP,Cer,100nF,10%,25VDC,X7R,0402; CreatedBy: Judd Foster; HelpURL: https://search.murata.co.jp/Ceramy/image/img/A01X/G101/ENG/GRM155R71E104KE14-01.pdf
L? = Ferrite,470R@100MHz,0402: 470 Ohms @ 100 MHz 1 Power Line Ferrite Bead 0402 (1005 Metric) 1A 200mOhm; Manufacturer 1: Murata Electronics; Manufacturer 1 Part Number: BLM15PX471SN1D; Vendor 1 Part Number: 490-10662-1-ND; Vendor 1: Digikey; Part Name: Ferrite,470R@100MHz,0402; CreatedBy: Judd Foster; HelpURL: https://www.murata.com/en-us/products/productdata/8796740059166/ENFA0018.pdf; Value: 470R
U? = MCP4725A0T-E/CH: 6us 12 I2C 2.7V~5.5V SOT-23-6 Digital To Analog Converters (DACs) ROHS; Manufacturer 1: Microchip; Vendor 1 Part Number: C144198; Vendor 1: LCSC; Part Name: MCP4725A0T-E/CH; CreatedBy: Judd Foster; HelpURL: https://datasheet.lcsc.com/lcsc/1811151442_Microchip-Tech-MCP4725A0T-E-CH_C144198.pdf; Manufacturer 1 Part Number: MCP4725A0T-E/CH

## Sheet Control.SchDoc
size 406 x 304 mm; SheetNumber: 4; SheetTotal: 8
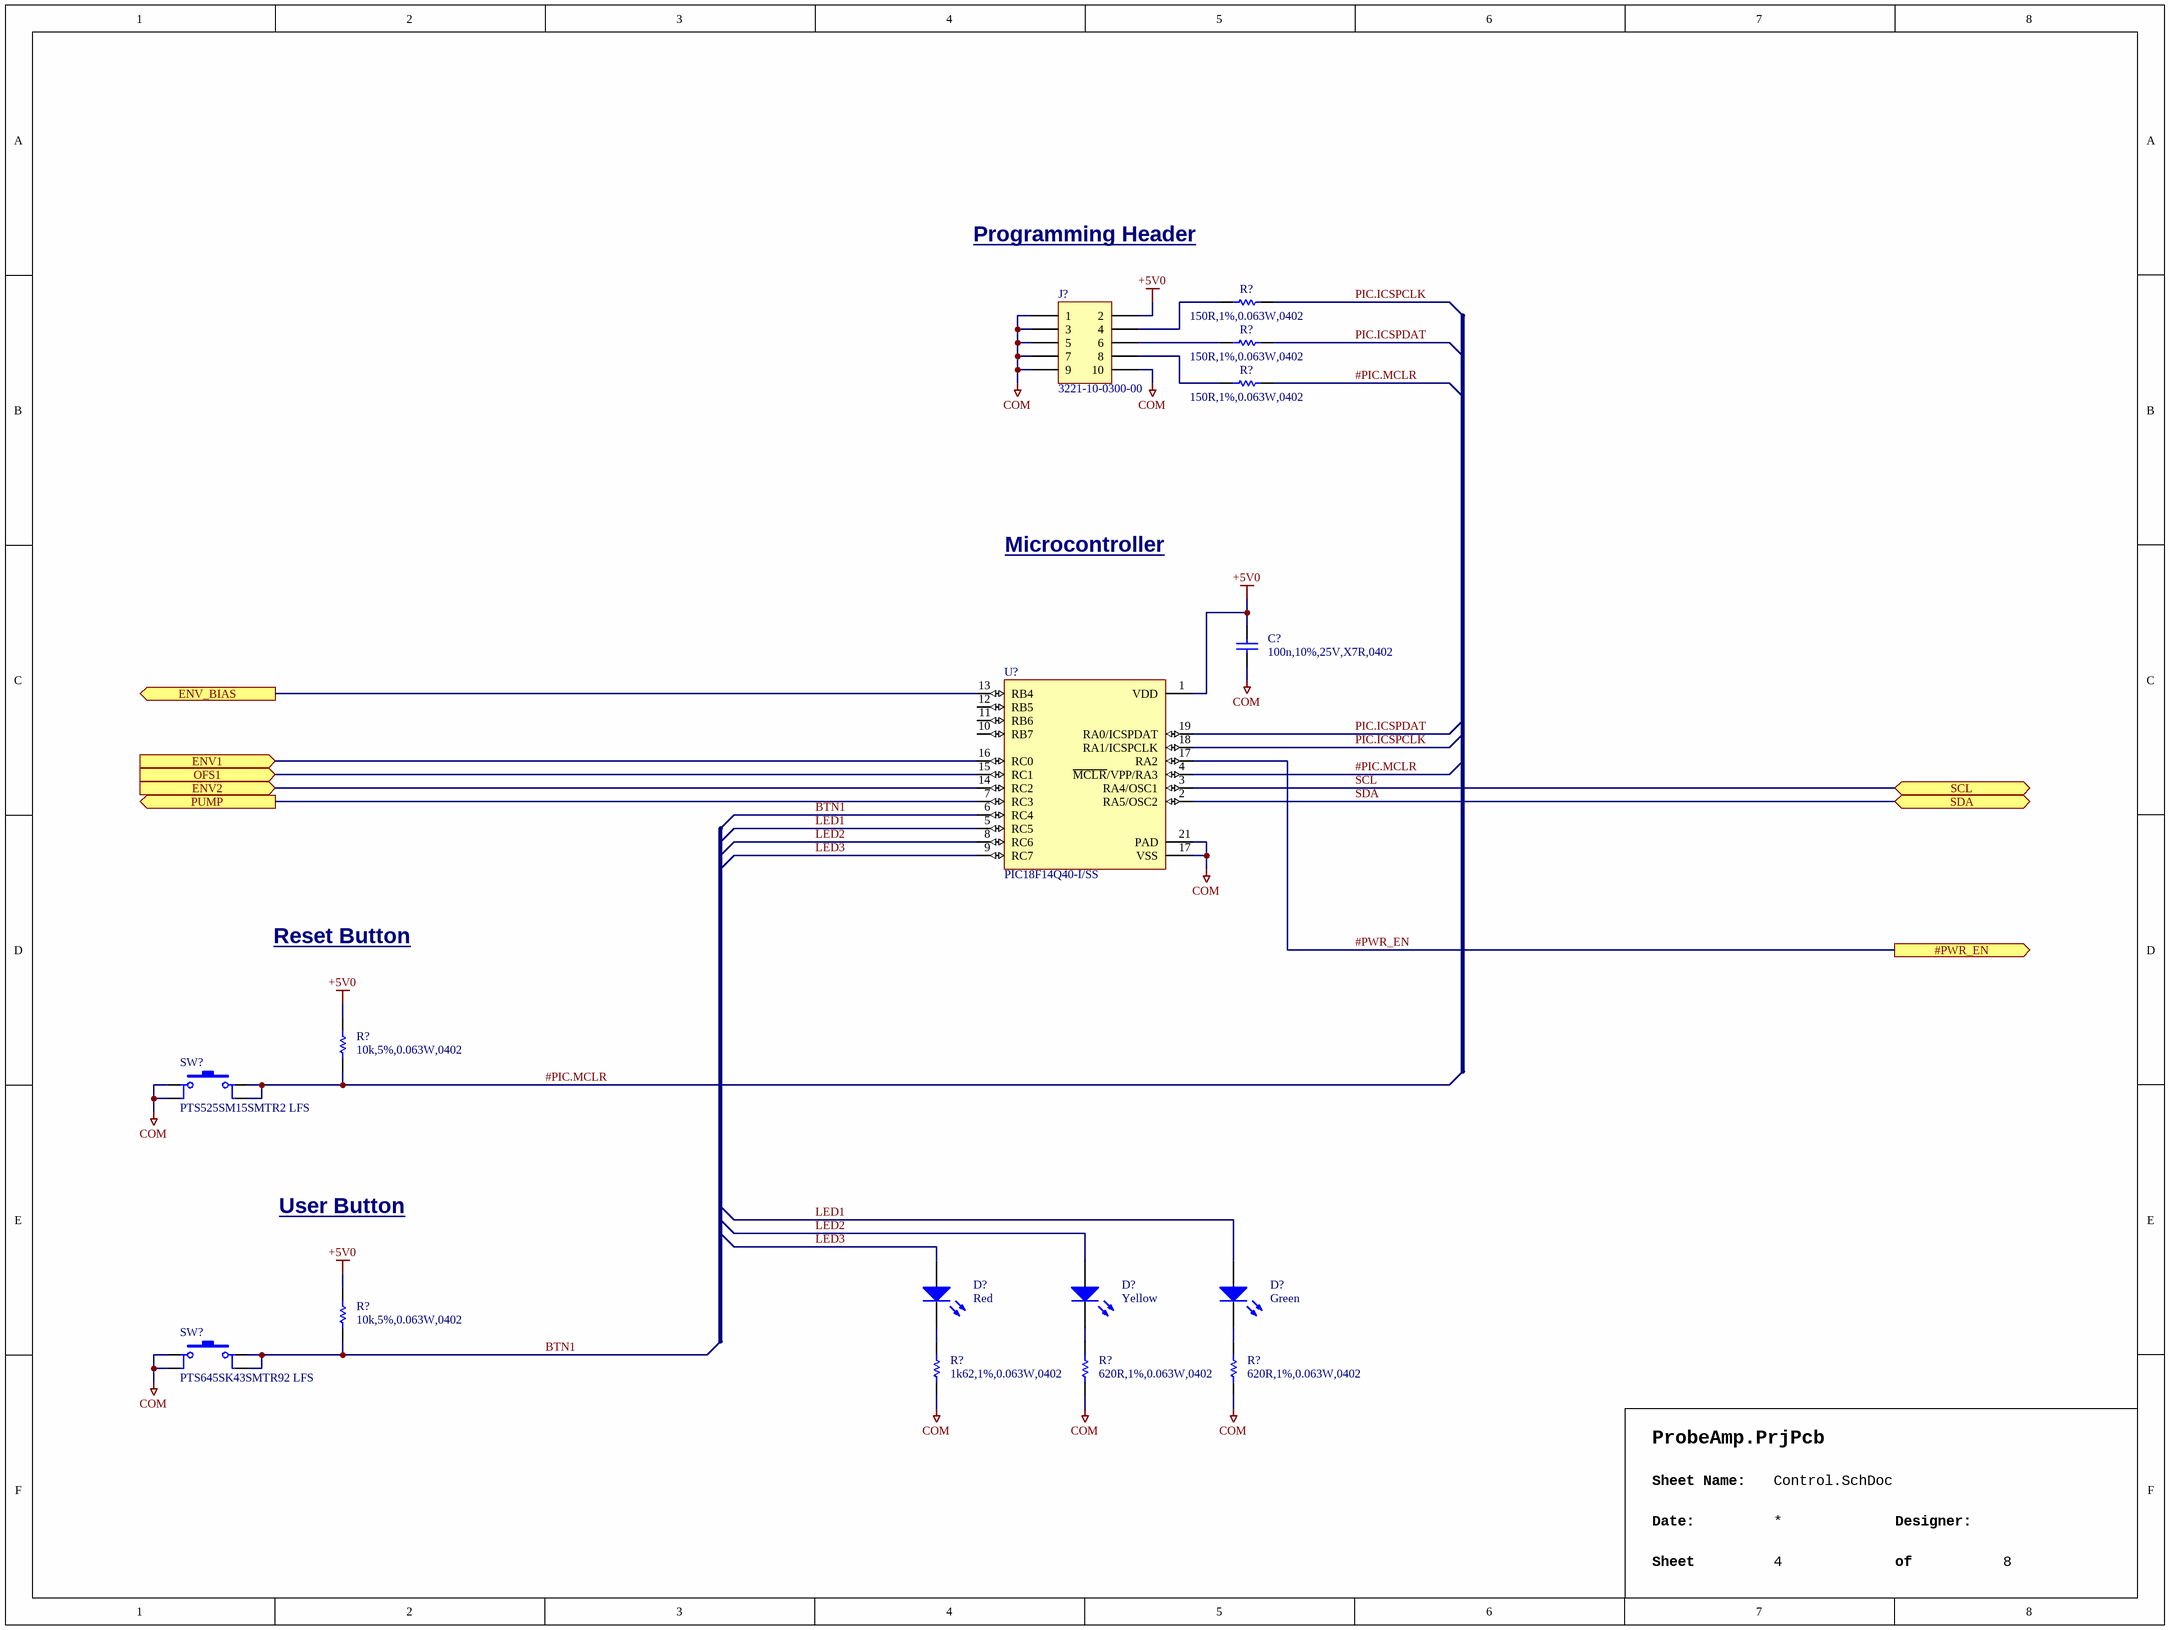
[diagram p4: Control.SchDoc]

### Parts
(Parts that share a designator on the sheet are numbered #1, #2 ... from top to bottom, then left to right.)
C?#38  100n,10%,25V,X7R,0402  [CAPC1005X06N]
D?#10  Red  [LITE-ON_LTST-C190KRKT]
D?#11  Yellow  [LITE-ON_LTST-C190KSKT]
D?#12  Green  [LITE-ON_LTST-C190KGKT]
J?#2  3221-10-0300-00  [CNC Tech_3221-10-0300-00]
R?#15  150R,1%,0.063W,0402  [RESC1005X04N]
R?#16  150R,1%,0.063W,0402  [RESC1005X04N]
R?#17  150R,1%,0.063W,0402  [RESC1005X04N]
R?#18  10k,5%,0.063W,0402  [RESC1005X04N]
R?#19  10k,5%,0.063W,0402  [RESC1005X04N]
R?#20  1k62,1%,0.063W,0402  [RESC1005X04N]
R?#21  620R,1%,0.063W,0402  [RESC1005X04N]
R?#22  620R,1%,0.063W,0402  [RESC1005X04N]
SW?#1  PTS525SM15SMTR2 LFS  [C&K_PTS525SM15SMTR2 LFS]
SW?#2  PTS645SK43SMTR92 LFS  [C&K_PTS645SK43SMTR92 LFS]
U?#12  PIC18F14Q40-I/SS  [MICROCHIP_PKG_SSOP20(C04-2072B)]

### Ports
#PWR_EN (out), ENV1 (in), ENV2 (in), ENV_BIAS (out), OFS1 (in), PUMP (out), SCL (bidir), SDA (bidir)

### Nets
+5V0: C?#38.2 J?#2.2 R?#18.2 R?#19.2 U?#12.1(VDD)  [project net A0]
COM: C?#38.1 J?#2.1 J?#2.3 J?#2.5 J?#2.7 J?#2.9 J?#2.10 R?#20.1 R?#21.1 R?#22.1 SW?#1.1 SW?#1.2 SW?#2.1 SW?#2.2 U?#12.17(VSS) U?#12.21(PAD)  [project net A0]
#PIC.MCLR: R?#17.2 R?#18.1 SW?#1.3 SW?#1.4 U?#12.4(~{MCLR}/VPP/RA3)
#PWR_EN: U?#12.17(RA2) ; port #PWR_EN
BTN1: R?#19.1 SW?#2.3 SW?#2.4 U?#12.6(RC4)
LED1: D?#12.A U?#12.5(RC5)
LED2: D?#11.A U?#12.8(RC6)
LED3: D?#10.A U?#12.9(RC7)
PIC.ICSPCLK: R?#15.2 U?#12.18(RA1/ICSPCLK)
PIC.ICSPDAT: R?#16.2 U?#12.19(RA0/ICSPDAT)
SCL: U?#12.3(RA4/OSC1) ; port SCL
SDA: U?#12.2(RA5/OSC2) ; port SDA
NetC?#28_1: U?#12.7(RC3) ; port PUMP
NetC?#43_2: U?#12.14(RC2) ; port ENV2
NetD?#1_1: U?#12.13(RB4) ; port ENV_BIAS
NetD?#10_C: D?#10.C R?#20.2
NetD?#11_C: D?#11.C R?#21.2
NetD?#12_C: D?#12.C R?#22.2
NetJ?#2_4: J?#2.4 R?#15.1
NetJ?#2_6: J?#2.6 R?#16.1
NetJ?#2_8: J?#2.8 R?#17.1
NetU?#9_1: U?#12.16(RC0) ; port ENV1
NetU?#10_6: U?#12.15(RC1) ; port OFS1

Not connected (* = marked no-connect by the designer): U?#12 10(RB7) 11(RB6) 12(RB5)

### Notes on the sheet
- Programming Header
- Microcontroller
- Reset Button
- User Button
- Sheet Name:
- Date:
- Sheet
- Designer:
- of

### Library data of the parts
C?#38 = CAP,Cer,100nF,10%,25V,X7R,0402: as C?#11 on sheet Power; Part Name: CAP,Cer,100nF,10%,25V,X7R,0402; CreatedBy: Judd Foster; HelpURL: https://search.murata.co.jp/Ceramy/image/img/A01X/G101/ENG/GRM155R71E104KE14-01.pdf
D?#10 = LED,Red,SMD,0603: Red 631nm LED Indication - Discrete 2V 0603 (1608 Metric); Manufacturer 1: Lite-On Inc.; Manufacturer 1 Part Number: LTST-C190KRKT; Vendor 1 Part Number: 160-1436-1-ND; Vendor 1: Digikey; Part Name: LED,Red,SMD,0603; CreatedBy: Judd Foster; HelpURL: https://optoelectronics.liteon.com/upload/download/DS-22-99-0151/LTST-C190KRKT.pdf; Value: Red
D?#11 = LED,Yellow,SMD,0603: Yellow 591nm LED Indication - Discrete 2.1V 0603 (1608 Metric); Manufacturer 1: Lite-On Inc.; Manufacturer 1 Part Number: LTST-C190KSKT; Vendor 1 Part Number: 160-1437-1-ND; Vendor 1: Digikey; Part Name: LED,Yellow,SMD,0603; CreatedBy: Judd Foster; HelpURL: https://optoelectronics.liteon.com/upload/download/DS-22-99-0189/LTST-C190KSKT.pdf; Value: Yellow
D?#12 = LED,Green,SMD,0603: Green 571nm LED Indication - Discrete 2V 0603 (1608 Metric); Manufacturer 1: Lite-On Inc.; Manufacturer 1 Part Number: LTST-C190KGKT; Vendor 1 Part Number: 160-1435-1-ND; Vendor 1: Digikey; Part Name: LED,Green,SMD,0603; CreatedBy: Judd Foster; HelpURL: https://optoelectronics.liteon.com/upload/download/DS22-2000-074/LTST-C190KGKT.PDF; Value: Green
J?#2 = Term,Header,5x2 Pin,Shroud,1.27mm,SMD: Connector Header Surface Mount 10 position 0.050" (1.27mm); Manufacturer 1: CNC Tech; Vendor 1 Part Number: 1175-1735-ND; Vendor 1: Digikey; Part Name: Term,Header,5x2 Pin,Shroud,1.27mm,SMD; CreatedBy: Judd Foster; HelpURL: http://www.cnctech.us/pdfs/3221-XX-0300-00_.pdf; Manufacturer 1 Part Number: 3221-10-0300-00
R?#15-R?#17 = RES,150R,1%,0.1W,0402: 150 Ohms ï¿½1% 0.063W, 1/16W Chip Resistor 0402 (1005 Metric) Automotive AEC-Q200, Moisture Resistant Thick Film; Manufacturer 1: TE Connectivity Passive Product; Manufacturer 1 Part Number: CRGCQ0402F150R; Vendor 1 Part Number: A129617CT-ND; Vendor 1: Digikey; Part Name: RES,150R,1%,0.1W,0402; CreatedBy: Judd Foster; HelpURL: https://www.te.com/commerce/DocumentDelivery/DDEController?Action=srchrtrv&DocNm=1773204-3&DocType=DS&DocLang=English; Value: 150R
R?#18 R?#19 = RES,10k,5%,0.063W,0402: as R?#1 on sheet Power; Part Name: RES,10k,5%,0.063W,0402; CreatedBy: Judd Foster; HelpURL: https://www.seielect.com/catalog/sei-rmcf_rmcp.pdf; Value: 10k
R?#20 = RES,1k62,1%,0.063W,0402: 1.62 kOhms Â±1% 0.063W, 1/16W Chip Resistor 0402 (1005 Metric) Moisture Resistant Thick Film; Manufacturer 1: YAGEO; Manufacturer 1 Part Number: RC0402FR-071K62L; Vendor 1 Part Number: YAG3042CT-ND; Vendor 1: DigiKey; Part Name: RES,1k62,1%,0.063W,0402; CreatedBy: Judd Foster; HelpURL: https://www.yageo.com/upload/media/product/products/datasheet/rchip/PYu-RC_Group_51_RoHS_L_12.pdf; Value: 1k62
R?#21 R?#22 = RES,620R,1%,0.063W,0402: 620 Ohms Â±1% 0.063W, 1/16W Chip Resistor 0402 (1005 Metric) Thin Film; Manufacturer 1: YAGEO; Manufacturer 1 Part Number: RT0402FRE07620RL; Vendor 1 Part Number: 13-RT0402FRE07620RLCT-ND; Vendor 1: DigiKey; Part Name: RES,620R,1%,0.063W,0402; CreatedBy: Judd Foster; HelpURL: https://www.yageo.com/upload/media/product/app/datasheet/rchip/pyu-rt_1-to-0.01_rohs_l.pdf; Value: 620R
SW?#1 = Switch,Tactile,SPST-NO,SMD,H1.5: Tactile Switch SPST-NO Top Actuated Surface Mount; Manufacturer 1: C&K; Vendor 1 Part Number: CKN9104CT-ND; Vendor 1: Digikey; Part Name: Switch,Tactile,SPST-NO,SMD,H1.5; CreatedBy: Judd Foster; HelpURL: https://www.ckswitches.com/media/1467/pts525.pdf; Manufacturer 1 Part Number: PTS525SM15SMTR2 LFS
SW?#2 = Switch,Tactile,SPST-NO,SMD,H4.3: Tactile Switch SPST-NO Top Actuated Surface Mount; Manufacturer 1: C&K; Vendor 1 Part Number: CKN9084CT-ND; Vendor 1: Digikey; Part Name: Switch,Tactile,SPST-NO,SMD,H4.3; CreatedBy: Judd Foster; HelpURL: https://www.ckswitches.com/media/1471/pts645.pdf; Manufacturer 1 Part Number: PTS645SK43SMTR92 LFS
U?#12 = PIC18F14Q40-I_SS: PIC PICÂ® 18F Microcontroller IC 8-Bit 64MHz 16KB (16K x 8) FLASH 20-SSOP; Manufacturer 1: Microchip Technology; Vendor 1 Part Number: 150-PIC18F14Q40-I/SS-ND; Vendor 1: DigiKey; Part Name: PIC18F14Q40-I_SS; CreatedBy: Judd Foster; HelpURL: https://ww1.microchip.com/downloads/en/DeviceDoc/PIC18F04-05-14-15-Q40-1420-Pin-Low-Power-High-Performance-Microcontroller-With-XLP-Technology-Data-Sheet-40002236B.pdf; Manufacturer 1 Part Number: PIC18F14Q40-I/SS

## Sheet Waveform Generator.SchDoc
size 406 x 304 mm; SheetNumber: 6; SheetTotal: 8
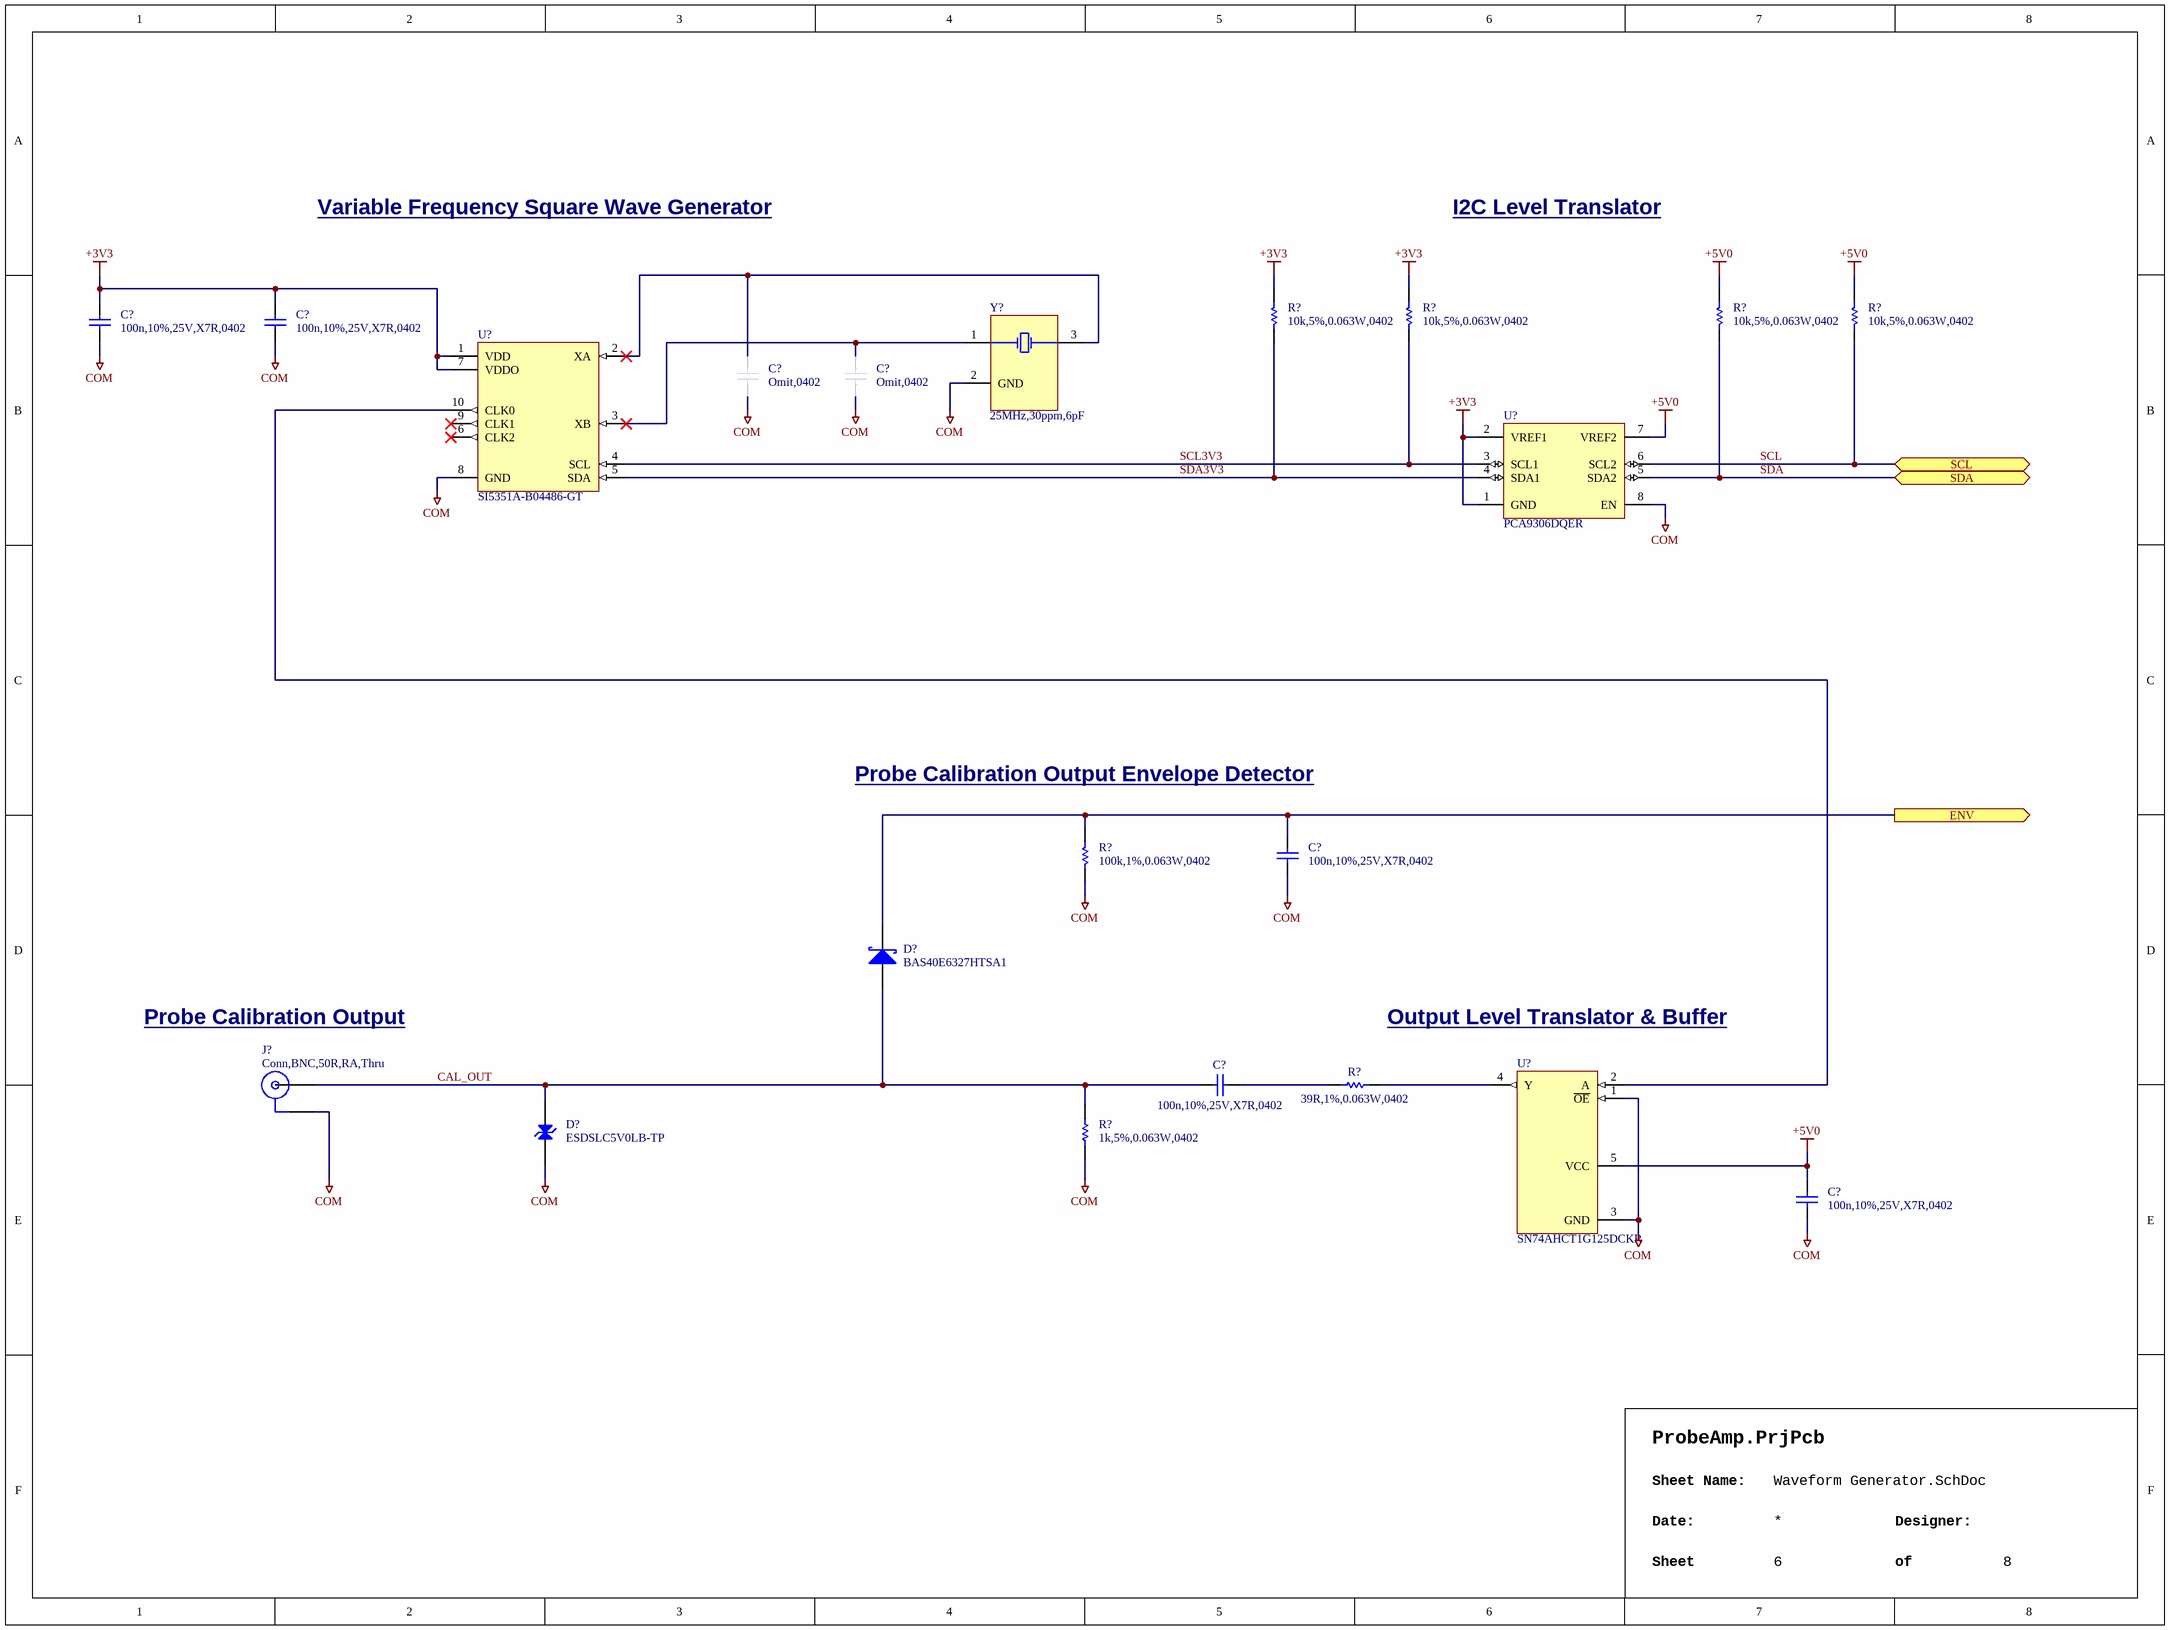
[diagram p5: Waveform Generator.SchDoc]

### Parts
(Parts that share a designator on the sheet are numbered #1, #2 ... from top to bottom, then left to right.)
C?#39  100n,10%,25V,X7R,0402  [CAPC1005X06N]
C?#40  100n,10%,25V,X7R,0402  [CAPC1005X06N]
C?#41  Omit,0402  [CAPC1005X06N]  (no BOM)
C?#42  Omit,0402  [CAPC1005X06N]  (no BOM)
C?#43  100n,10%,25V,X7R,0402  [CAPC1005X06N]
C?#44  100n,10%,25V,X7R,0402  [CAPC1005X06N]
C?#45  100n,10%,25V,X7R,0402  [CAPC1005X06N]
D?#13  BAS40E6327HTSA1  [INFINEON_PKG_SOT23]
D?#14  ESDSLC5V0LB-TP  [MICROCOMMERCIAL_DFN1006-2_NPOL]
J?#3  Conn,BNC,50R,RA,Thru  [TE-CONNECTIVITY_CONBNC002]
R?#23  10k,5%,0.063W,0402  [RESC1005X04N]
R?#24  10k,5%,0.063W,0402  [RESC1005X04N]
R?#25  10k,5%,0.063W,0402  [RESC1005X04N]
R?#26  10k,5%,0.063W,0402  [RESC1005X04N]
R?#27  100k,1%,0.063W,0402  [RESC1005X04N]
R?#28  39R,1%,0.063W,0402  [RESC1005X04N]
R?#29  1k,5%,0.063W,0402  [RESC1005X04N]
U?#13  SI5351A-B04486-GT  [SKYWORKS_10-MSOP]
U?#14  PCA9306DQER  [TEXASINSTRUMENTS_DQE0008A]
U?#15  SN74AHCT1G125DCKR  [TEXASINSTRUMENTS_PKG_DCK0005A]
Y?  25MHz,30ppm,6pF  [MURATA_PKG_XRCGB]

### Ports
ENV (out), SCL (bidir), SDA (bidir)

### Nets
+3V3: C?#39.2 C?#40.2 R?#23.2 R?#24.2 U?#13.1(VDD) U?#13.7(VDDO) U?#14.1(GND) U?#14.2(VREF1)
+5V0: C?#45.2 R?#25.2 R?#26.2 U?#14.7(VREF2) U?#15.5(VCC)  [project net A0]
COM: C?#39.1 C?#40.1 C?#41.1 C?#42.1 C?#43.1 C?#45.1 D?#14.2(A) J?#3.2 R?#27.1 R?#29.1 U?#13.8(GND) U?#14.8(EN) U?#15.1(~{OE}) U?#15.3(GND) Y?.2(GND)  [project net A0]
CAL_OUT: C?#44.2 D?#13.1(A) D?#14.1(K) J?#3.1 R?#29.2
SCL: R?#26.1 U?#14.6(SCL2) ; port SCL
SCL3V3: R?#24.1 U?#13.4(SCL) U?#14.3(SCL1)
SDA: R?#25.1 U?#14.5(SDA2) ; port SDA
SDA3V3: R?#23.1 U?#13.5(SDA) U?#14.4(SDA1)
NetC?#41_2: C?#41.2 U?#13.2(XA) Y?.3(GND)
NetC?#42_2: C?#42.2 U?#13.3(XB) Y?.1(OSC1)
NetC?#43_2: C?#43.2 D?#13.3(K) R?#27.2 ; port ENV
NetC?#44_1: C?#44.1 R?#28.1
NetR?#28_2: R?#28.2 U?#15.4(Y)
NetU?#13_10: U?#13.10(CLK0) U?#15.2(A)

Not connected (* = marked no-connect by the designer): U?#13 6(CLK2)* 9(CLK1)*

### Notes on the sheet
- Variable Frequency Square Wave Generator
- I2C Level Translator
- Probe Calibration Output Envelope Detector
- Probe Calibration Output
- Output Level Translator & Buffer
- Sheet Name:
- Date:
- Sheet
- Designer:
- of

### Library data of the parts
C?#39 C?#40 C?#43-C?#45 = CAP,Cer,100nF,10%,25V,X7R,0402: as C?#11 on sheet Power; Part Name: CAP,Cer,100nF,10%,25V,X7R,0402; CreatedBy: Judd Foster; HelpURL: https://search.murata.co.jp/Ceramy/image/img/A01X/G101/ENG/GRM155R71E104KE14-01.pdf
C?#41 C?#42 = CAP,Omit,0402: Omit; Part Name: CAP,Omit,0402; CreatedBy: Judd Foster; HelpURL: N/A; Manufacturer 1: N/A; Manufacturer 1 Part Number: N/A; Vendor 1: N/A; Vendor 1 Part Number: N/A; Value: Omit
D?#13 = Diode,Schottky,40V,1A,SOT23: as D2 on sheet ProbeAmp; Part Name: Diode,Schottky,40V,1A,SOT23; CreatedBy: Judd Foster; HelpURL: https://rocelec.widen.net/view/pdf/ukzfofyli6/INFNS19700-1.pdf?t.download=true&u=5oefqw; Manufacturer 1 Part Number: BAS40E6327HTSA1
D?#14 = DIODE,TVS,5.0V,SOD882: 20V Clamp 4A (8/20ï¿½s) Ipp Tvs Diode Surface Mount 2-DFN1006; Manufacturer 1: Micro Commercial Co; Vendor 1 Part Number: ESDSLC5V0LB-TPMSCT-ND; Vendor 1: Digikey; Part Name: DIODE,TVS,5.0V,SOD882; CreatedBy: Judd Foster; HelpURL: https://www.mccsemi.com/pdf/Products/ESDSLC5V0LB(DFN1006-2).pdf; Manufacturer 1 Part Number: ESDSLC5V0LB-TP
J?#3 = Conn,BNC,50R,RA,Thru: BNC Connector Jack, Female Socket 50 Ohms Panel Mount, Through Hole, Right Angle Solder; Manufacturer 1: TE Connectivity Linx; Manufacturer 1 Part Number: CONBNC002; Vendor 1 Part Number: 343-CONBNC002-ND; Vendor 1: DigiKey; Part Name: Conn,BNC,50R,RA,Thru; CreatedBy: Judd Foster; HelpURL: https://www.te.com/commerce/DocumentDelivery/DDEController?Action=srchrtrv&DocNm=CONBNC002&DocType=Data+Sheet&DocLang=English&DocFormat=pdf&PartCntxt=CONBNC002
R?#23-R?#26 = RES,10k,5%,0.063W,0402: as R?#1 on sheet Power; Part Name: RES,10k,5%,0.063W,0402; CreatedBy: Judd Foster; HelpURL: https://www.seielect.com/catalog/sei-rmcf_rmcp.pdf; Value: 10k
R?#27 = RES,100k,1%,0.063W,0402: as R?#2 on sheet Power; Part Name: RES,100k,1%,0.063W,0402; CreatedBy: Judd Foster; HelpURL: https://www.yageo.com/upload/media/product/products/datasheet/rchip/PYu-RC_Group_51_RoHS_L_12.pdf; Value: 100k
R?#28 = RES,39R,1%,0.063W,0402: 39 Ohms ï¿½1% 0.063W, 1/16W Chip Resistor 0402 (1005 Metric) Moisture Resistant Thick Film; Manufacturer 1: YAGEO; Manufacturer 1 Part Number: RC0402FR-0739RL; Vendor 1 Part Number: 311-39.0LRCT-ND; Vendor 1: Digikey; Part Name: RES,39R,1%,0.063W,0402; CreatedBy: Judd Foster; HelpURL: https://www.yageo.com/upload/media/product/productsearch/datasheet/rchip/PYu-RC_Group_51_RoHS_L_12.pdf; Value: 39R
R?#29 = RES,1k,5%,0.063W,0402: as R?#9 on sheet Power; Part Name: RES,1k,5%,0.063W,0402; CreatedBy: Judd Foster; HelpURL: https://www.seielect.com/catalog/sei-rmcf_rmcp.pdf; Value: 1k
U?#13 = SI5351A-B04486-GT: Clock Generator IC 200MHz 2 10-TFSOP, 10-MSOP (0.118", 3.00mm Width); Manufacturer 1: Skyworks Solutions Inc.; Vendor 1 Part Number: 336-3529-5-ND; Vendor 1: DigiKey; Part Name: SI5351A-B04486-GT; CreatedBy: Judd Foster; HelpURL: https://www.skyworksinc.com/-/media/Skyworks/SL/documents/public/data-sheets/Si5351-B.pdf; Manufacturer 1 Part Number: SI5351A-B04486-GT
U?#14 = PCA9306DQER: Voltage Level Translator Bidirectional 1 Circuit 2 Channel 8-X2SON (1.4x1); Manufacturer 1: Texas Instruments; Vendor 1 Part Number: 296-27957-1-ND; Vendor 1: Digikey; Part Name: PCA9306DQER; CreatedBy: Judd Foster; HelpURL: https://www.ti.com/lit/ds/symlink/pca9306.pdf?HQS=dis-dk-null-digikeymode-dsf-pf-null-wwe&ts=1705616121609&ref_url=https%253A%252F%252Fwww.ti.com%252Fgeneral%252Fdocs%252Fsuppproductinfo.tsp%253FdistId%253D10%2526gotoUrl%253Dhttps%253A%252F%252Fwww.ti.com; Manufacturer 1 Part Number: PCA9306DQER
U?#15 = SN74AHCT1G125DCKR: Buffer, Non-Inverting 1 Element 1 Bit per Element 3-State Output SC-70-5; Manufacturer 1: Texas Instruments; Vendor 1 Part Number: 296-4709-1-ND; Vendor 1: DigiKey; Part Name: SN74AHCT1G125DCKR; CreatedBy: Judd Foster; HelpURL: https://www.ti.com/lit/ds/symlink/sn74ahct1g125.pdf?HQS=dis-dk-null-digikeymode-dsf-pf-null-wwe&ts=1736760249757&ref_url=https%253A%252F%252Fwww.ti.com%252Fgeneral%252Fdocs%252Fsuppproductinfo.tsp%253FdistId%253D10%2526gotoUrl%253Dhttps%253A%252F%252Fwww.; Manufacturer 1 Part Number: SN74AHCT1G125DCKR
Y? = XTAL,25.0000MHz,30ppm,6pF,SMD: 25 MHz Â±30ppm Crystal 6pF 150 Ohms 4-SMD, No Lead; Manufacturer 1: Murata Electronics; Manufacturer 1 Part Number: XRCGB25M000F3M00R0; Vendor 1 Part Number: 490-5578-1-ND; Vendor 1: DigiKey; Part Name: XTAL,25.0000MHz,30ppm,6pF,SMD; CreatedBy: Judd Foster; HelpURL: https://www.murata.com/~/media/webrenewal/campaign/ads/america/timing/p79e.ashx?la=en-us; Value: 25MHz

## Sheet Gain Scaling.SchDoc
size 406 x 304 mm; SheetNumber: 7; SheetTotal: 8
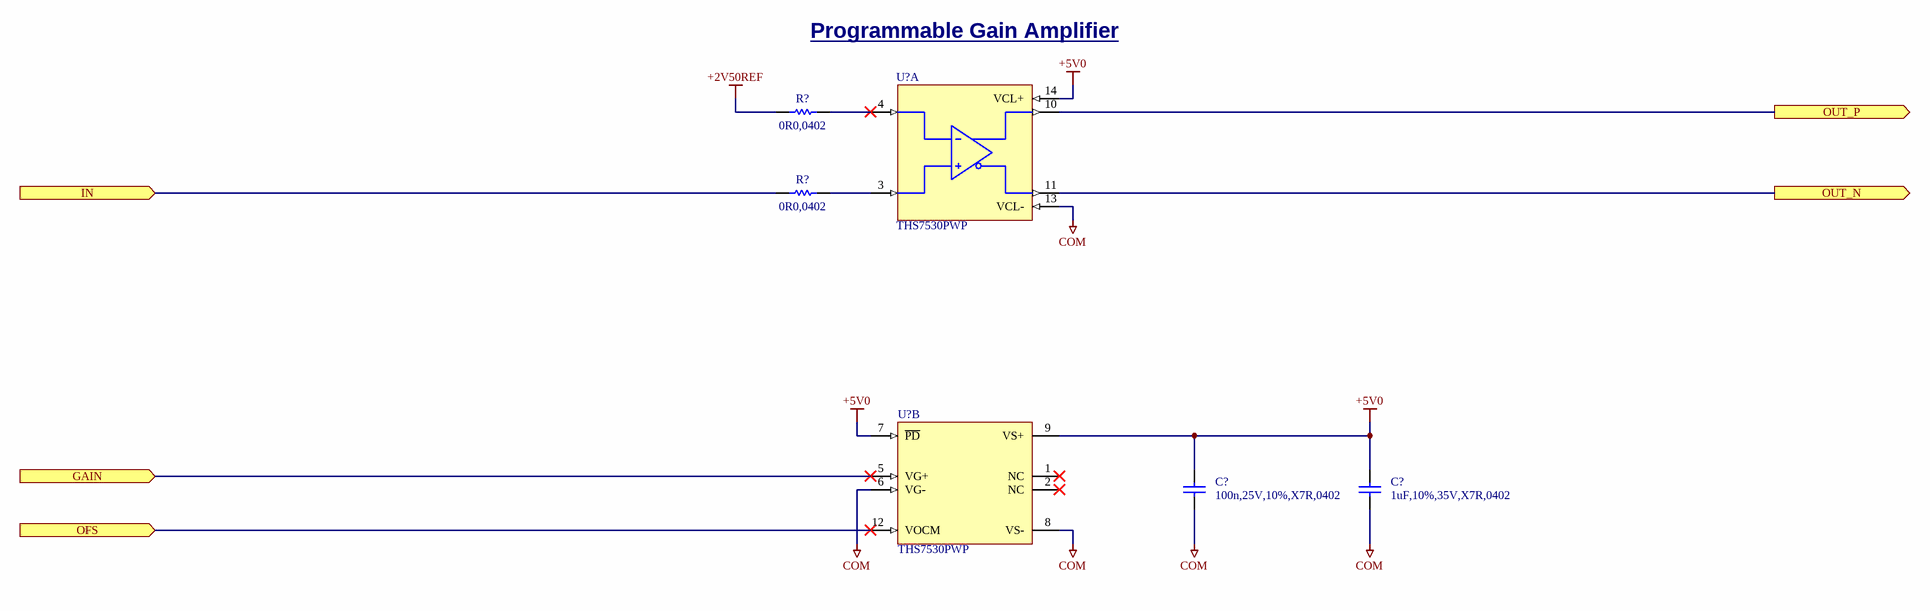
[diagram p6: Gain Scaling.SchDoc]

### Parts
(Parts that share a designator on the sheet are numbered #1, #2 ... from top to bottom, then left to right.)
C?#46  100n,25V,10%,X7R,0402  [CAPC1005X06N]
C?#47  1uF,10%,35V,X7R,0402  [CAPC1005X06N]
R?#30  0R0,0402  [RESC1005X04N]
R?#31  0R0,0402  [RESC1005X04N]
U?#16  THS7530PWP  [TEXASINSTRUMENTS_PKG_PWP0014J]  (part A of 2)
U?#17  THS7530PWP  [TEXASINSTRUMENTS_PKG_PWP0014J]  (part B of 2)

### Ports
GAIN (in), IN (in), OFS (in), OUT_N (out), OUT_P (out)

### Nets
+2V50REF: R?#30.1
+5V0: C?#46.2 C?#47.2 U?#16.14(VCL+) U?#17.7(~{PD}) U?#17.9(VS+)  [project net A0]
COM: C?#46.1 C?#47.1 U?#16.13(VCL-) U?#17.6(VG-) U?#17.8(VS-)  [project net A0]
NetC?#48_2: U?#16.10(VOUT+) ; port OUT_P
NetC?#50_2: U?#16.11(VOUT-) ; port OUT_N
NetC?_DAC1#2_2: U?#17.5(VG+) ; port GAIN
NetC?_DAC2#2_2: U?#17.12(VOCM) ; port OFS
NetD2_1: R?#31.1 ; port IN
NetR?#30_2: R?#30.2 U?#16.4(VIN-)
NetR?#31_2: R?#31.2 U?#16.3(VIN+)

Not connected (* = marked no-connect by the designer): U?#17 1(NC)* 2(NC)*

### Notes on the sheet
- Programmable Gain Amplifier
- Sheet Name:
- Date:
- Sheet
- Designer:
- of

### Library data of the parts
C?#46 = CAP,Cer,100nF,10%,25VDC,X7R,0402: as C?#3 on sheet Power; Part Name: CAP,Cer,100nF,10%,25VDC,X7R,0402; CreatedBy: Judd Foster; HelpURL: https://search.murata.co.jp/Ceramy/image/img/A01X/G101/ENG/GRM155R71E104KE14-01.pdf
C?#47 = CAP,Cer,1uF,35VDC,X5R,0402: as C?#1 on sheet Power; Part Name: CAP,Cer,1uF,35VDC,X5R,0402; CreatedBy: Judd Foster; HelpURL: https://product.tdk.com/info/en/catalog/datasheets/mlcc_commercial_general_en.pdf?ref_disty=digikey
R?#30 R?#31 = RES,0R0,0402: as R?#14 on sheet ProbeAmp; Part Name: RES,0R0,0402; CreatedBy: Judd Foster; HelpURL: https://industrial.panasonic.com/cdbs/www-data/pdf/RDA0000/AOA0000C301.pdf
U?#16 U?#17 = THS7530PWP: Variable Gain Amplifier 1 Circuit Differential 14-HTSSOP; Manufacturer 1: Texas Instruments; Vendor 1 Part Number: 296-15181-5-ND; Vendor 1: DigiKey; Part Name: THS7530PWP; CreatedBy: Judd Foster; HelpURL: https://www.ti.com/lit/ds/symlink/ths7530-q1.pdf?ts=1736214928306&ref_url=https%253A%252F%252Fwww.ti.com%252Famplifier-circuit%252Fpga-vga%252Fproducts.html; Manufacturer 1 Part Number: THS7530PWP

## Sheet Output Amplifier.SchDoc
size 406 x 304 mm; SheetNumber: 8; SheetTotal: 8
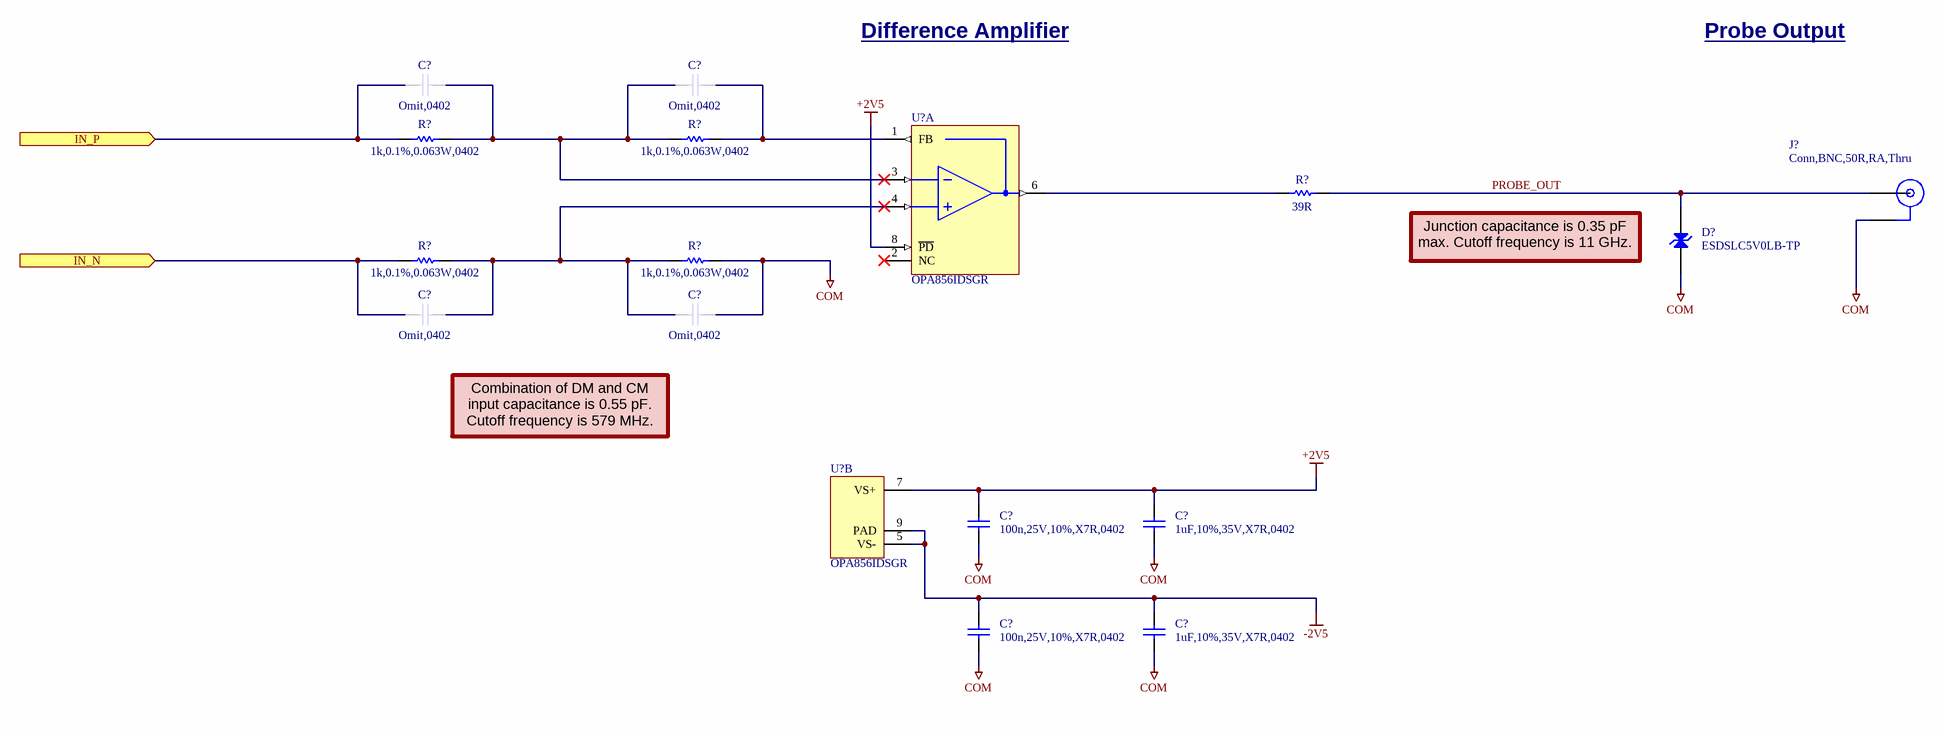
[diagram p7: Output Amplifier.SchDoc]

### Parts
(Parts that share a designator on the sheet are numbered #1, #2 ... from top to bottom, then left to right.)
C?#48  Omit,0402  [CAPC1005X06N]  (no BOM)
C?#49  Omit,0402  [CAPC1005X06N]  (no BOM)
C?#50  Omit,0402  [CAPC1005X06N]  (no BOM)
C?#51  Omit,0402  [CAPC1005X06N]  (no BOM)
C?#52  100n,25V,10%,X7R,0402  [CAPC1005X06N]
C?#53  1uF,10%,35V,X7R,0402  [CAPC1005X06N]
C?#54  100n,25V,10%,X7R,0402  [CAPC1005X06N]
C?#55  1uF,10%,35V,X7R,0402  [CAPC1005X06N]
D?#15  ESDSLC5V0LB-TP  [MICROCOMMERCIAL_DFN1006-2_NPOL]
J?#4  Conn,BNC,50R,RA,Thru  [TE-CONNECTIVITY_CONBNC002]
R?#32  1k,0.1%,0.063W,0402  [RESC1005X04N]
R?#33  1k,0.1%,0.063W,0402  [RESC1005X04N]
R?#34  39R  [RESC1005X04N]
R?#35  1k,0.1%,0.063W,0402  [RESC1005X04N]
R?#36  1k,0.1%,0.063W,0402  [RESC1005X04N]
U?#18  OPA856IDSGR  [TEXASINSTRUMENTS_PKG_DSG0008A]  (part A of 2)
U?#19  OPA856IDSGR  [TEXASINSTRUMENTS_PKG_DSG0008A]  (part B of 2)

### Ports
IN_N (in), IN_P (in)

### Nets
+2V5: C?#52.2 C?#53.2 U?#18.8(~{PD}) U?#19.7(VS+)
-2V5: C?#54.2 C?#55.2 U?#19.5(VS-) U?#19.9(PAD)
COM: C?#51.1 C?#52.1 C?#53.1 C?#54.1 C?#55.1 D?#15.2(A) J?#4.2 R?#36.2  [project net A0]
PROBE_OUT: D?#15.1(K) J?#4.1 R?#34.2
NetC?#48_1: C?#48.1 C?#49.2 R?#32.2 R?#33.1 U?#18.3(IN-)
NetC?#48_2: C?#48.2 R?#32.1 ; port IN_P
NetC?#49_1: C?#49.1 R?#33.2 U?#18.1(FB)
NetC?#50_1: C?#50.1 C?#51.2 R?#35.2 R?#36.1 U?#18.4(IN+)
NetC?#50_2: C?#50.2 R?#35.1 ; port IN_N
NetR?#34_1: R?#34.1 U?#18.6(OUT)

Not connected (* = marked no-connect by the designer): U?#18 2(NC)*

### Notes on the sheet
- Difference Amplifier
- Probe Output
- (near D?#15) Junction capacitance is 0.35 pF max. Cutoff frequency is 11 GHz.
- Combination of DM and CM input capacitance is 0.55 pF. Cutoff frequency is 579 MHz.
- Sheet Name:
- Date:
- Sheet
- Designer:
- of

### Library data of the parts
C?#48-C?#51 = CAP,Omit,0402: Omit; Part Name: CAP,Omit,0402; CreatedBy: Judd Foster; HelpURL: N/A; Manufacturer 1: N/A; Manufacturer 1 Part Number: N/A; Vendor 1: N/A; Vendor 1 Part Number: N/A; Value: Omit
C?#52 C?#54 = CAP,Cer,100nF,10%,25VDC,X7R,0402: as C?#3 on sheet Power; Part Name: CAP,Cer,100nF,10%,25VDC,X7R,0402; CreatedBy: Judd Foster; HelpURL: https://search.murata.co.jp/Ceramy/image/img/A01X/G101/ENG/GRM155R71E104KE14-01.pdf
C?#53 C?#55 = CAP,Cer,1uF,35VDC,X5R,0402: as C?#1 on sheet Power; Part Name: CAP,Cer,1uF,35VDC,X5R,0402; CreatedBy: Judd Foster; HelpURL: https://product.tdk.com/info/en/catalog/datasheets/mlcc_commercial_general_en.pdf?ref_disty=digikey
D?#15 = DIODE,TVS,5.0V,SOD882: as D?#14 on sheet Waveform Generator; Part Name: DIODE,TVS,5.0V,SOD882; CreatedBy: Judd Foster; HelpURL: https://www.mccsemi.com/pdf/Products/ESDSLC5V0LB(DFN1006-2).pdf; Manufacturer 1 Part Number: ESDSLC5V0LB-TP
J?#4 = Conn,BNC,50R,RA,Thru: as J?#3 on sheet Waveform Generator; Part Name: Conn,BNC,50R,RA,Thru; CreatedBy: Judd Foster; HelpURL: https://www.te.com/commerce/DocumentDelivery/DDEController?Action=srchrtrv&DocNm=CONBNC002&DocType=Data+Sheet&DocLang=English&DocFormat=pdf&PartCntxt=CONBNC002
R?#32 R?#33 R?#35 R?#36 = RES,1k,0.1%,0.063W,0402: 1 kOhms Â±0.1% 0.063W, 1/16W Chip Resistor 0402 (1005 Metric) Thin Film; Manufacturer 1: YAGEO; Manufacturer 1 Part Number: RT0402BRE071KL; Vendor 1 Part Number: YAG2306CT-ND; Vendor 1: DigiKey; Part Name: RES,1k,0.1%,0.063W,0402; CreatedBy: Judd Foster; HelpURL: https://www.yageo.com/upload/media/product/app/datasheet/rchip/pyu-rt_1-to-0.01_rohs_l.pdf; Value: 1k
R?#34 = RES,39R,1%,0.063W,0402: as R?#28 on sheet Waveform Generator; Part Name: RES,39R,1%,0.063W,0402; CreatedBy: Judd Foster; HelpURL: https://www.yageo.com/upload/media/product/productsearch/datasheet/rchip/PYu-RC_Group_51_RoHS_L_12.pdf; Value: 39R
U?#18 U?#19 = OPA856IDSGR: as U1 on sheet ProbeAmp; Part Name: OPA856IDSGR; CreatedBy: Judd Foster; HelpURL: https://www.ti.com/lit/ds/symlink/opa856.pdf?HQS=dis-dk-null-digikeymode-dsf-pf-null-wwe&ts=1736226484393; Manufacturer 1 Part Number: OPA856IDSGR

## Nets that join several sheets
+2V5: Power (C?#12.2 C?#13.2 U?#2.5), Output Amplifier (C?#52.2 C?#53.2 U?#18.8 U?#19.7)
+2V50REF: Power (C?#20.2 R?#8.2 R?#10.2), ProbeAmp (U1.4), Gain Scaling (R?#30.1)
+3V3: Power (C?#23.2 C?#24.2 U?#7.1), Waveform Generator (8 pins)
-2V5: Power (C?#16.2 C?#17.2 U?#4.5), Output Amplifier (C?#54.2 C?#55.2 U?#19.5 U?#19.9)
A0: Power (20 pins), ProbeAmp (8 pins), DAC1 (C?_DAC1#1.2 U?_DAC1.3 U?_DAC1.6), DAC2 (C?_DAC2#1.2 U?_DAC2.3), Control (5 pins), Waveform Generator (5 pins), Gain Scaling (5 pins)
A0: Power (38 pins), ProbeAmp (15 pins), DAC1 (C?_DAC1#1.1 C?_DAC1#2.1 U?_DAC1.2), DAC2 (C?_DAC2#1.1 C?_DAC2#2.1 U?_DAC2.2 U?_DAC2.6), Control (16 pins), Waveform Generator (15 pins), Gain Scaling (5 pins), Output Amplifier (8 pins)
#PWR_EN: Power (R?#1.1), Control (U?#12.17)
NetC?#28_1: ProbeAmp (C?#28.1 C?#30.1 C?#32.1 C?#34.1), Control (U?#12.7)
NetC?#43_2: Control (U?#12.14), Waveform Generator (C?#43.2 D?#13.3 R?#27.2)
NetC?#48_2: Gain Scaling (U?#16.10), Output Amplifier (C?#48.2 R?#32.1)
NetC?#50_2: Gain Scaling (U?#16.11), Output Amplifier (C?#50.2 R?#35.1)
NetC?_DAC1#2_2: DAC1 (C?_DAC1#2.2 L?_DAC1.1), Gain Scaling (U?#17.5)
NetC?_DAC2#2_2: DAC2 (C?_DAC2#2.2 L?_DAC2.1), Gain Scaling (U?#17.12)
NetD2_1: ProbeAmp (D2.1 R9.2 U1.6), Gain Scaling (R?#31.1)
NetD?#1_1: ProbeAmp (D?#1.1), Control (U?#12.13)
NetU?#9_1: ProbeAmp (U?#9.1 U?#9.2), Control (U?#12.16)
NetU?#10_6: ProbeAmp (U?#10.6 U?#10.7), Control (U?#12.15)
SCL: DAC1 (U?_DAC1.5), DAC2 (U?_DAC2.5), Control (U?#12.3), Waveform Generator (R?#26.1 U?#14.6)
SDA: DAC1 (U?_DAC1.4), DAC2 (U?_DAC2.4), Control (U?#12.2), Waveform Generator (R?#25.1 U?#14.5)